# Altium project RespiraWorks Ventilator.PrjPcb (part 1 of 2)
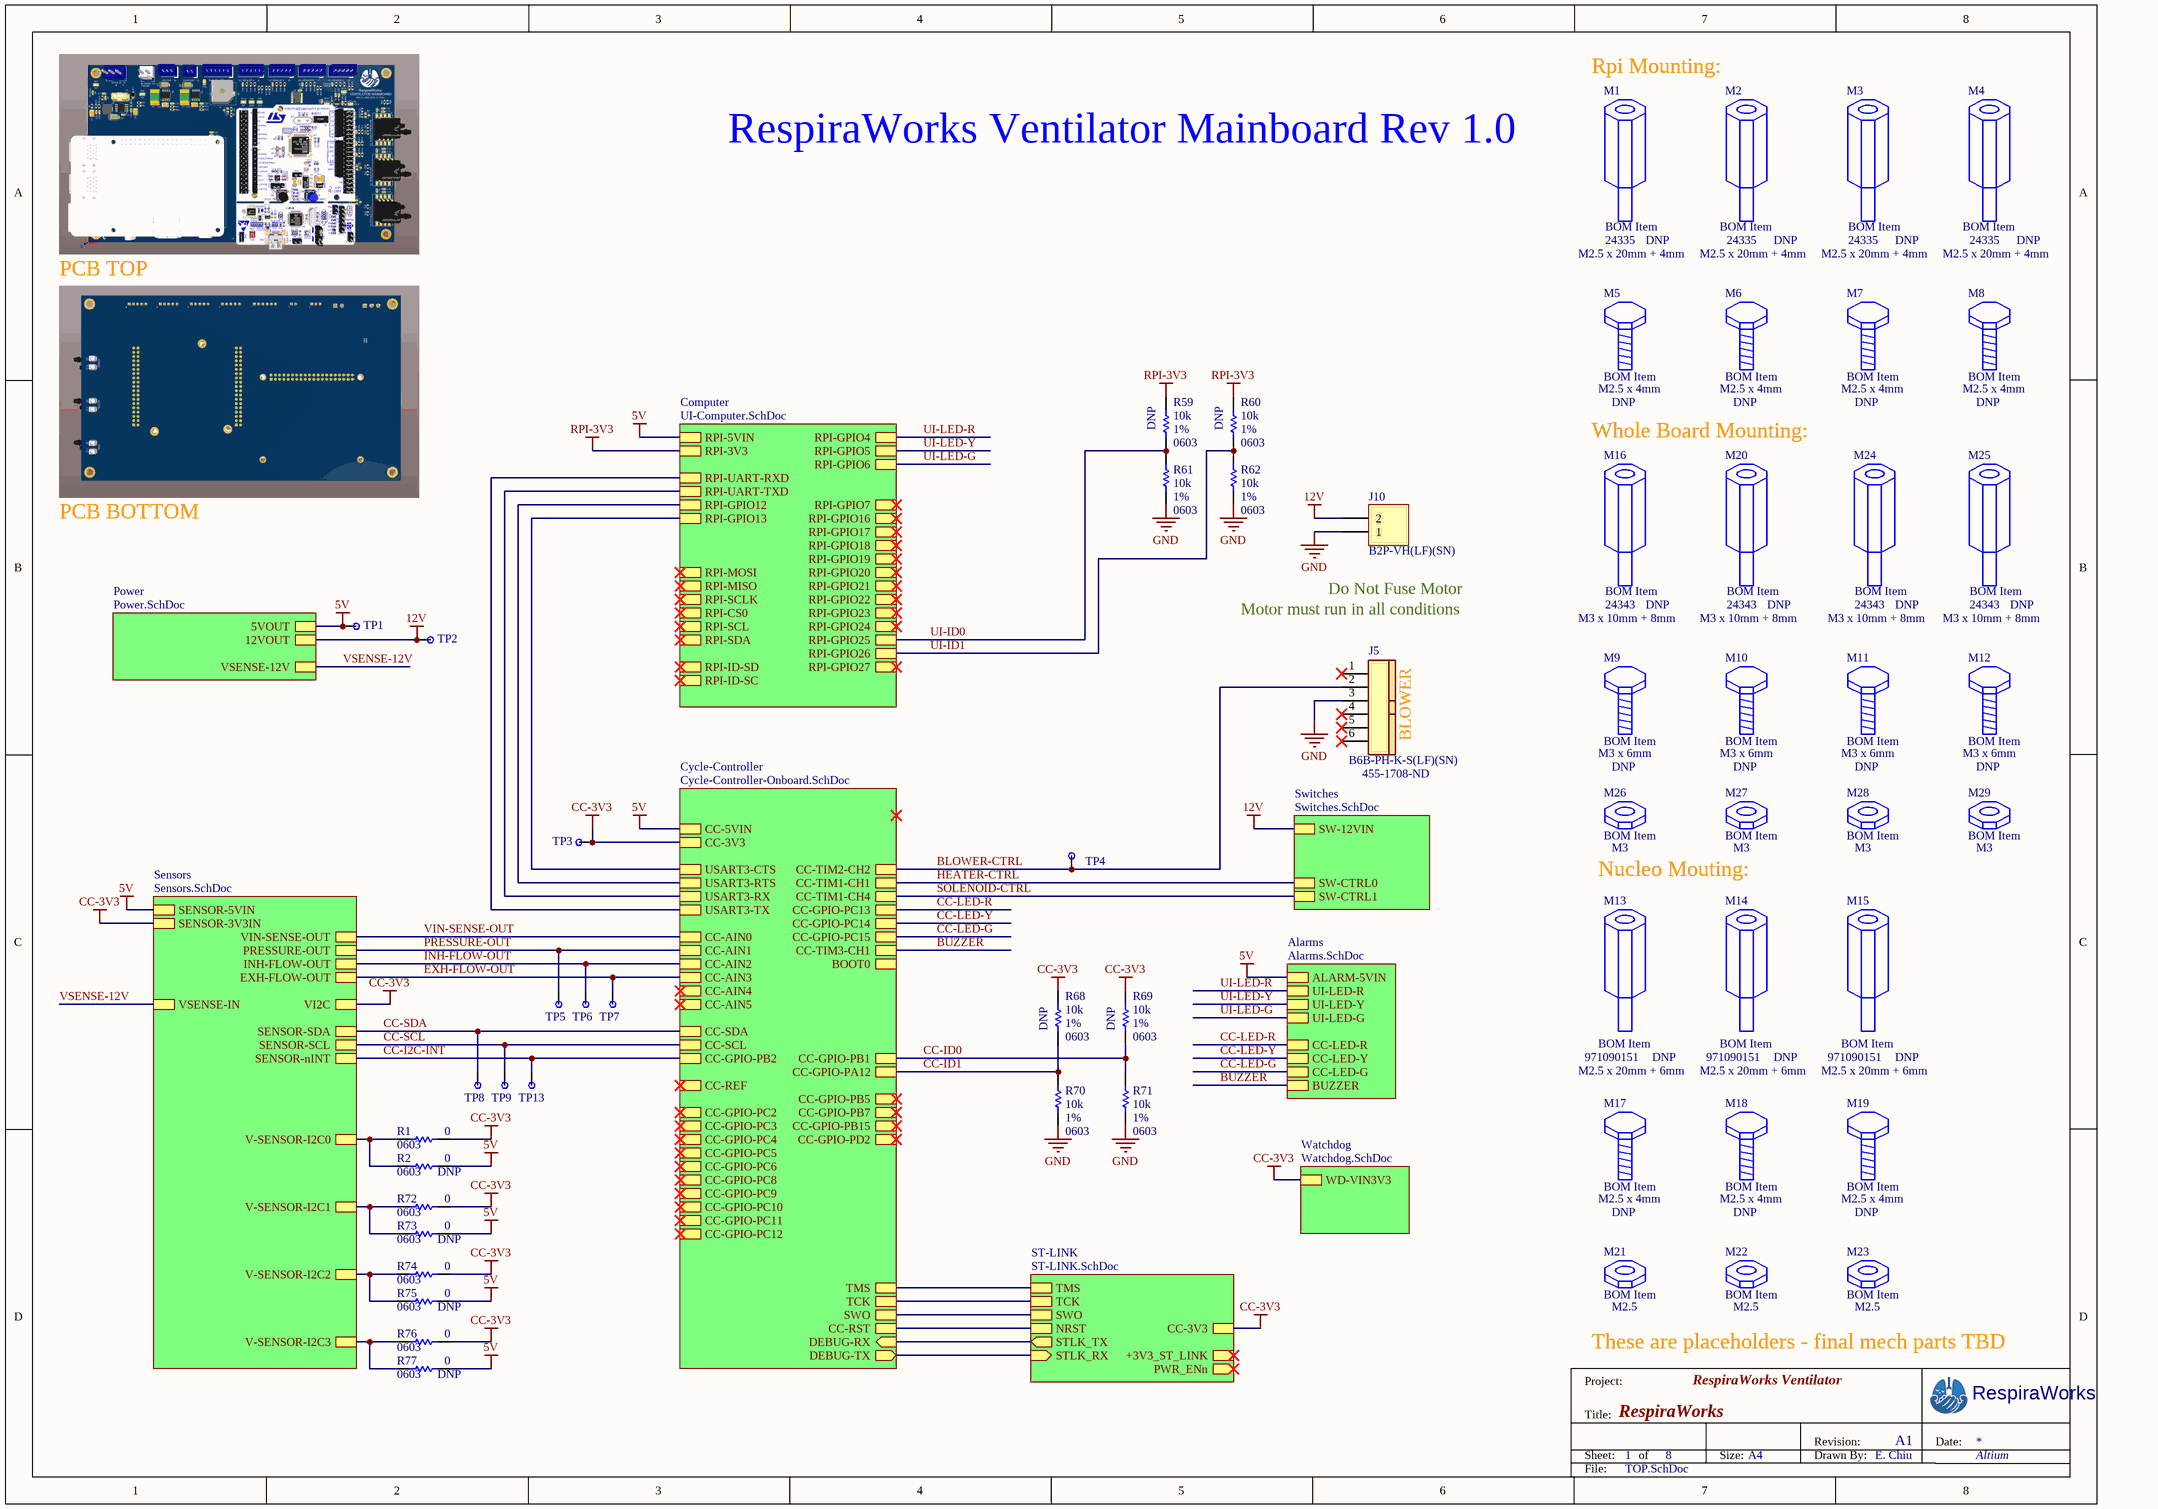
[diagram p0: TOP.SchDoc]
7 sheets, 242 parts. Net scope: hierarchical (ports join the sheet entries above them; power ports are global).
Board file: RespiraWorks Ventilator Rev 1.PcbDoc
Sheets:
  TOP.SchDoc
    Cycle-Controller = Cycle-Controller-Onboard.SchDoc
    Sensors = Sensors.SchDoc
    Switches = Switches.SchDoc
    Watchdog = Watchdog.SchDoc
    Power = Power.SchDoc
    ST-LINK = ST-LINK.SchDoc

## Sheet TOP.SchDoc: RespiraWorks
size A3; CompanyName: RespiraWorks; DrawnBy: E. Chiu; Organization: Altium; DocumentNumber: 1; Revision: A1; SheetNumber: 1; SheetTotal: 8; PageSetup: Record=PageOptions|CenterHorizontal=True|CenterVertical=True|PrintScale=0.67|XCorrection=1.00|YCorrection=1.00|PrintKind=0|BorderSize=5000000|LeftOffset=0|BottomOffset=0|Orientation=2|PaperLength=1000|PaperWidth=1000|Scale=100|PaperSource=276|PrintQuality=-3|MediaType=1|DitherType=10|PrintScaleMode=1|PaperKind=11"x17" 279.4x431.8mm|PaperIndex=3; ProjectName: FALCON 3S

### Parts
J5  B6B-PH-K-S(LF)(SN)  Supplier Part Number 1: 455-1708-ND  [JST_B6B-XH-AM]
J10  B2P-VH(LF)(SN)  [B2P-VH(LF)(SN)]
M1  BOM Item  value M2.5 x 20mm + 4mm  Manufacturer P/N: 24335  Do Not Populate: DNP  (mechanical)
M2  BOM Item  value M2.5 x 20mm + 4mm  Manufacturer P/N: 24335  Do Not Populate: DNP  (mechanical)
M3  BOM Item  value M2.5 x 20mm + 4mm  Manufacturer P/N: 24335  Do Not Populate: DNP  (mechanical)
M4  BOM Item  value M2.5 x 20mm + 4mm  Manufacturer P/N: 24335  Do Not Populate: DNP  (mechanical)
M5  BOM Item  value M2.5 x 4mm  Do Not Populate: DNP  (mechanical)
M6  BOM Item  value M2.5 x 4mm  Do Not Populate: DNP  (mechanical)
M7  BOM Item  value M2.5 x 4mm  Do Not Populate: DNP  (mechanical)
M8  BOM Item  value M2.5 x 4mm  Do Not Populate: DNP  (mechanical)
M9  BOM Item  value M3 x 6mm  Do Not Populate: DNP  (mechanical)
M10  BOM Item  value M3 x 6mm  Do Not Populate: DNP  (mechanical)
M11  BOM Item  value M3 x 6mm  Do Not Populate: DNP  (mechanical)
M12  BOM Item  value M3 x 6mm  Do Not Populate: DNP  (mechanical)
M13  BOM Item  value M2.5 x 20mm + 6mm  Manufacturer P/N: 971090151  Do Not Populate: DNP  (mechanical)
M14  BOM Item  value M2.5 x 20mm + 6mm  Manufacturer P/N: 971090151  Do Not Populate: DNP  (mechanical)
M15  BOM Item  value M2.5 x 20mm + 6mm  Manufacturer P/N: 971090151  Do Not Populate: DNP  (mechanical)
M16  BOM Item  value M3 x 10mm + 8mm  Manufacturer P/N: 24343  Do Not Populate: DNP  (mechanical)
M17  BOM Item  value M2.5 x 4mm  Do Not Populate: DNP  (mechanical)
M18  BOM Item  value M2.5 x 4mm  Do Not Populate: DNP  (mechanical)
M19  BOM Item  value M2.5 x 4mm  Do Not Populate: DNP  (mechanical)
M20  BOM Item  value M3 x 10mm + 8mm  Manufacturer P/N: 24343  Do Not Populate: DNP  (mechanical)
M21  BOM Item  value M2.5  (mechanical)
M22  BOM Item  value M2.5  (mechanical)
M23  BOM Item  value M2.5  (mechanical)
M24  BOM Item  value M3 x 10mm + 8mm  Manufacturer P/N: 24343  Do Not Populate: DNP  (mechanical)
M25  BOM Item  value M3 x 10mm + 8mm  Manufacturer P/N: 24343  Do Not Populate: DNP  (mechanical)
M26  BOM Item  value M3  (mechanical)
M27  BOM Item  value M3  (mechanical)
M28  BOM Item  value M3  (mechanical)
M29  BOM Item  value M3  (mechanical)
R1  value 0  PCB Package: 0603  [RES0603]  (hidden comment: RES 0603)
R2  value 0  PCB Package: 0603  Do Not Populate: DNP  [RES0603]  (hidden comment: RES 0603)
R59  value 10k  PCB Package: 0603  Tolerance: 1%  Do Not Populate: DNP  [RES0603]  (hidden comment: RES 0603)
R60  value 10k  PCB Package: 0603  Tolerance: 1%  Do Not Populate: DNP  [RES0603]  (hidden comment: RES 0603)
R61  value 10k  PCB Package: 0603  Tolerance: 1%  [RES0603]  (hidden comment: RES 0603)
R62  value 10k  PCB Package: 0603  Tolerance: 1%  [RES0603]  (hidden comment: RES 0603)
R68  value 10k  PCB Package: 0603  Tolerance: 1%  Do Not Populate: DNP  [RES0603]  (hidden comment: RES 0603)
R69  value 10k  PCB Package: 0603  Tolerance: 1%  Do Not Populate: DNP  [RES0603]  (hidden comment: RES 0603)
R70  value 10k  PCB Package: 0603  Tolerance: 1%  [RES0603]  (hidden comment: RES 0603)
R71  value 10k  PCB Package: 0603  Tolerance: 1%  [RES0603]  (hidden comment: RES 0603)
R72  value 0  PCB Package: 0603  [RES0603]  (hidden comment: RES 0603)
R73  value 0  PCB Package: 0603  Do Not Populate: DNP  [RES0603]  (hidden comment: RES 0603)
R74  value 0  PCB Package: 0603  [RES0603]  (hidden comment: RES 0603)
R75  value 0  PCB Package: 0603  Do Not Populate: DNP  [RES0603]  (hidden comment: RES 0603)
R76  value 0  PCB Package: 0603  [RES0603]  (hidden comment: RES 0603)
R77  value 0  PCB Package: 0603  Do Not Populate: DNP  [RES0603]  (hidden comment: RES 0603)
TP1  TP-SMT  [TP-5015]  (value not drawn)
TP2  TP-SMT  [TP-5015]  (value not drawn)
TP3  TP-SMT  [TP-5015]  (value not drawn)
TP4  TP-SMT  [TP-5015]  (value not drawn)
TP5  TP-SMT  [TP-5015]  (value not drawn)
TP6  TP-SMT  [TP-5015]  (value not drawn)
TP7  TP-SMT  [TP-5015]  (value not drawn)
TP8  TP-SMT  [TP-5015]  (value not drawn)
TP9  TP-SMT  [TP-5015]  (value not drawn)
TP13  TP-SMT  [TP-5015]  (value not drawn)

### Sub-sheets
Alarms = Alarms.SchDoc (file not in this document): BUZZER, CC-LED-R, UI-LED-Y, CC-LED-G, UI-LED-G, UI-LED-R, CC-LED-Y, ALARM-5VIN
Computer = UI-Computer.SchDoc (file not in this document): RPI-SDA, RPI-SCL, RPI-GPIO6, RPI-GPIO7, RPI-ID-SC, RPI-GPIO12, RPI-GPIO24, RPI-GPIO25, RPI-GPIO4, RPI-GPIO18, RPI-UART-TXD, RPI-GPIO16, RPI-SCLK, RPI-GPIO27, RPI-MOSI, RPI-3V3, RPI-MISO, RPI-GPIO17, RPI-GPIO20, RPI-GPIO23, RPI-GPIO19, RPI-ID-SD, RPI-GPIO22, RPI-GPIO26, RPI-CS0, RPI-UART-RXD, RPI-GPIO13, RPI-GPIO21, RPI-GPIO5, RPI-5VIN
Cycle-Controller = Cycle-Controller-Onboard.SchDoc: CC-3V3, CC-AIN5, CC-AIN1, CC-TIM2-CH2, CC-AIN2, CC-GPIO-PA12, CC-TIM1-CH1, CC-TIM3-CH1, CC-GPIO-PB1, CC-RST, CC-AIN3, CC-GPIO-PB5, CC-AIN4, CC-AIN0, CC-REF, CC-5VIN, CC-SCL, CC-SDA, USART3-RX, USART3-CTS, USART3-TX, USART3-RTS, CC-GPIO-PC14, CC-GPIO-PC13, CC-GPIO-PC15, CC-GPIO-PB2, CC-TIM1-CH4, CC-GPIO-PC11, CC-GPIO-PC10, CC-GPIO-PC4, CC-GPIO-PB15, CC-GPIO-PC2, CC-GPIO-PC8, CC-GPIO-PC5, CC-GPIO-PC9, CC-GPIO-PC6, CC-GPIO-PC12, CC-GPIO-PD2, CC-GPIO-PC3, CC-GPIO-PB7, BOOT0, TCK, DEBUG-TX (out), SWO, DEBUG-RX (in), TMS
Power = Power.SchDoc: 5VOUT, VSENSE-12V, 12VOUT
Sensors = Sensors.SchDoc: INH-FLOW-OUT, SENSOR-5VIN, PRESSURE-OUT, EXH-FLOW-OUT, VIN-SENSE-OUT, VSENSE-IN, SENSOR-SDA, V-SENSOR-I2C0, VI2C, SENSOR-nINT, SENSOR-SCL, SENSOR-3V3IN, V-SENSOR-I2C1, V-SENSOR-I2C3, V-SENSOR-I2C2
ST-LINK = ST-LINK.SchDoc: STLK_RX (in), STLK_TX (out), PWR_ENn (out), CC-3V3, TCK, TMS, NRST, SWO, +3V3_ST_LINK
Switches = Switches.SchDoc: SW-CTRL1, SW-12VIN, SW-CTRL0
Watchdog = Watchdog.SchDoc: WD-VIN3V3

### Nets
5V: R2.2 R73.2 R75.2 R77.2 TP1.1 ; sheet Cycle-Controller/CC-5VIN, sheet Computer/RPI-5VIN, sheet Sensors/SENSOR-5VIN, sheet Alarms/ALARM-5VIN, sheet Power/5VOUT
12V: J10.2 TP2.1 ; sheet Sensors/VSENSE-IN, sheet Switches/SW-12VIN, sheet Power/VSENSE-12V, sheet Power/12VOUT  [also labelled VSENSE-12V]
CC-3V3: R1.2 R68.2 R69.2 R72.2 R74.2 R76.2 TP3.1 ; sheet Cycle-Controller/CC-3V3, sheet Sensors/VI2C, sheet Sensors/SENSOR-3V3IN, sheet Watchdog/WD-VIN3V3, sheet ST-LINK/CC-3V3
GND: J5.3 J10.1 R61.1 R62.1 R70.1 R71.1
RPI-3V3: R59.2 R60.2 ; sheet Computer/RPI-3V3
BLOWER-CTRL: J5.2 TP4.1 ; sheet Cycle-Controller/CC-TIM2-CH2
BUZZER: sheet Cycle-Controller/CC-TIM3-CH1, sheet Alarms/BUZZER
CC-I2C-INT: TP13.1 ; sheet Cycle-Controller/CC-GPIO-PB2, sheet Sensors/SENSOR-nINT
CC-ID0: R69.1 R71.2 ; sheet Cycle-Controller/CC-GPIO-PB1
CC-ID1: R68.1 R70.2 ; sheet Cycle-Controller/CC-GPIO-PA12
CC-LED-G: sheet Cycle-Controller/CC-GPIO-PC15, sheet Alarms/CC-LED-G
CC-LED-R: sheet Cycle-Controller/CC-GPIO-PC13, sheet Alarms/CC-LED-R
CC-LED-Y: sheet Cycle-Controller/CC-GPIO-PC14, sheet Alarms/CC-LED-Y
CC-SCL: TP9.1 ; sheet Cycle-Controller/CC-SCL, sheet Sensors/SENSOR-SCL
CC-SDA: TP8.1 ; sheet Cycle-Controller/CC-SDA, sheet Sensors/SENSOR-SDA
EXH-FLOW-OUT: TP7.1 ; sheet Cycle-Controller/CC-AIN3, sheet Sensors/EXH-FLOW-OUT
HEATER-CTRL: sheet Cycle-Controller/CC-TIM1-CH1, sheet Switches/SW-CTRL0
INH-FLOW-OUT: TP6.1 ; sheet Cycle-Controller/CC-AIN2, sheet Sensors/INH-FLOW-OUT
NRST: sheet Cycle-Controller/CC-RST, sheet ST-LINK/NRST
PRESSURE-OUT: TP5.1 ; sheet Cycle-Controller/CC-AIN1, sheet Sensors/PRESSURE-OUT
SOLENOID-CTRL: sheet Cycle-Controller/CC-TIM1-CH4, sheet Switches/SW-CTRL1
STLK_RX: sheet Cycle-Controller/DEBUG-TX, sheet ST-LINK/STLK_RX
STLK_TX: sheet Cycle-Controller/DEBUG-RX, sheet ST-LINK/STLK_TX
T_JTCK: sheet Cycle-Controller/TCK, sheet ST-LINK/TCK
T_JTMS: sheet Cycle-Controller/TMS, sheet ST-LINK/TMS
T_SWO: sheet Cycle-Controller/SWO, sheet ST-LINK/SWO
UI-ID0: R59.1 R61.2 ; sheet Computer/RPI-GPIO25
UI-ID1: R60.1 R62.2 ; sheet Computer/RPI-GPIO26
UI-LED-G: sheet Computer/RPI-GPIO6, sheet Alarms/UI-LED-G
UI-LED-R: sheet Computer/RPI-GPIO4, sheet Alarms/UI-LED-R
UI-LED-Y: sheet Computer/RPI-GPIO5, sheet Alarms/UI-LED-Y
V-SENSOR-I2C0: R1.1 R2.1 ; sheet Sensors/V-SENSOR-I2C0
V-SENSOR-I2C1: R72.1 R73.1 ; sheet Sensors/V-SENSOR-I2C1
V-SENSOR-I2C2: R74.1 R75.1 ; sheet Sensors/V-SENSOR-I2C2
V-SENSOR-I2C3: R76.1 R77.1 ; sheet Sensors/V-SENSOR-I2C3
VIN-SENSE-OUT: sheet Cycle-Controller/CC-AIN0, sheet Sensors/VIN-SENSE-OUT
(unnamed): sheet Cycle-Controller/USART3-RX, sheet Computer/RPI-UART-TXD
(unnamed): sheet Cycle-Controller/USART3-CTS, sheet Computer/RPI-GPIO13
(unnamed): sheet Cycle-Controller/USART3-TX, sheet Computer/RPI-UART-RXD
(unnamed): sheet Cycle-Controller/USART3-RTS, sheet Computer/RPI-GPIO12

Not connected (* = marked no-connect by the designer): J5 1* 4* 5* 6*

### Notes on the sheet
- Rpi Mounting:
- (near M1) RespiraWorks Ventilator Mainboard Rev 1.0
- PCB TOP
- Whole Board Mounting:
- PCB BOTTOM
- Motor must run in all conditions
- Do Not Fuse Motor
- (near J5) BLOWER
- Nucleo Mouting:
- Project:
- These are placeholders - final mech parts TBD
- RespiraWorks Ventilator
- Title:
- Sheet:
- of
- Size:
- A4
- Drawn By:
- Revision:
- Date:
- File:

### Library data of the parts
J5 = B6B-PH-K-S(LF)(SN): CONN HEADER PH TOP 6POS 2MM; Manufacturer: JST Sales America Inc.; Connector Type: Header, Shrouded; Number of Positions: 6; Number of Positions Loaded: All; Pitch: 0.079" (2.00mm); Supplier 1: Digi-Key; Manufacturer Part Number: B6B-PH-K-S(LF)(SN); RoHS: RoHS Compliant; Category: Connectors, Interconnects; Stock 1: 30111; Pricing 1: 1=0.33, 10=0.313, 100=0.2194, 500=0.18808, 1000=0.15674, 5000=0.13435, 10000=0.12539 (USD); Packaging: Bulk; Part Status: Active; Contact Type: Male Pin; Number of Rows: 1; Row Spacing: -; Contact Mating Length: 0.130" (3.30mm); Mounting Type: Through Hole; Termination: Press-Fit, Solder; Fastening Type: Detent Lock; Features: -; Contact Finish: Tin; Contact Finish Thickness: -; Color: Natural; ComponentLink1URL: http://www.jst-mfg.com/product/pdf/eng/ePH.pdf; ComponentLink1Description: http://www.jst-mfg.com/product/pdf/eng/ePH.pdf; Manufacturer P/N: B6B-PH-K-S(LF)(SN)
J10 = B2P-VH(LF)(SN): JST-VH HEADER VERT 2POS 3.96MM; Manufacturer: JST; Do Not Populate: *; Manufacturer P/N: B2P-VH(LF)(SN)
M1-M4 M16 M20 M24 M25 = STANDOFF: [BOM Item] Generic Standoff; Manufacturer: Keystone
M5-M8 M17-M19 = SCREW: [BOM Item] Generic Nut; Manufacturer: Keystone; Manufacturer P/N: 29300
M9-M12 = SCREW: [BOM Item] Generic Nut; Manufacturer: Keystone; Manufacturer P/N: 29311
M13-M15 = STANDOFF: [BOM Item] Generic Standoff; Manufacturer: Wurth
M21-M23 = NUT: [BOM Item] Generic Nut; Manufacturer: Keystone; Manufacturer P/N: 4707; Do Not Populate: DNP
M26-M29 = NUT: [BOM Item] Generic Nut; Manufacturer: B&F; Manufacturer P/N: MHNZ 003; Do Not Populate: DNP
R1 R2 R72-R77 = RES 0603: Manufacturer P/N: RC0603JR-070RL; Manufacturer: Yageo; Tolerance: 5%
  R1 R72 R74 R76: Do Not Populate: *
R59-R62 R68-R71 = RES 0603: Manufacturer P/N: ERJ-3EKF1002V; Manufacturer: Panasonic
  R61 R62 R70 R71: Do Not Populate: *
TP1-TP9 TP13 = TP-SMT: Keystone 5015 SMT Mini Testpoint; Manufacturer P/N: 5015; Manufacturer: Keystone; PCB Package: TP-5015; Tolerance: 5015; Do Not Populate: *; Value: *

## Sheet Cycle-Controller-Onboard.SchDoc: RespiraWorks
size A3; CompanyName: RespiraWorks; DrawnBy: E. Chiu; Organization: Altium; DocumentNumber: 4; Revision: A1; SheetNumber: 4; SheetTotal: 8; PageSetup: Record=PageOptions|CenterHorizontal=True|CenterVertical=True|PrintScale=0.67|XCorrection=1.00|YCorrection=1.00|PrintKind=0|BorderSize=5000000|LeftOffset=0|BottomOffset=0|Orientation=2|PaperLength=1000|PaperWidth=1000|Scale=100|PaperSource=276|PrintQuality=-3|MediaType=1|DitherType=10|PrintScaleMode=1|PaperKind=11"x17" 279.4x431.8mm|PaperIndex=3; ProjectName: FALCON 3S
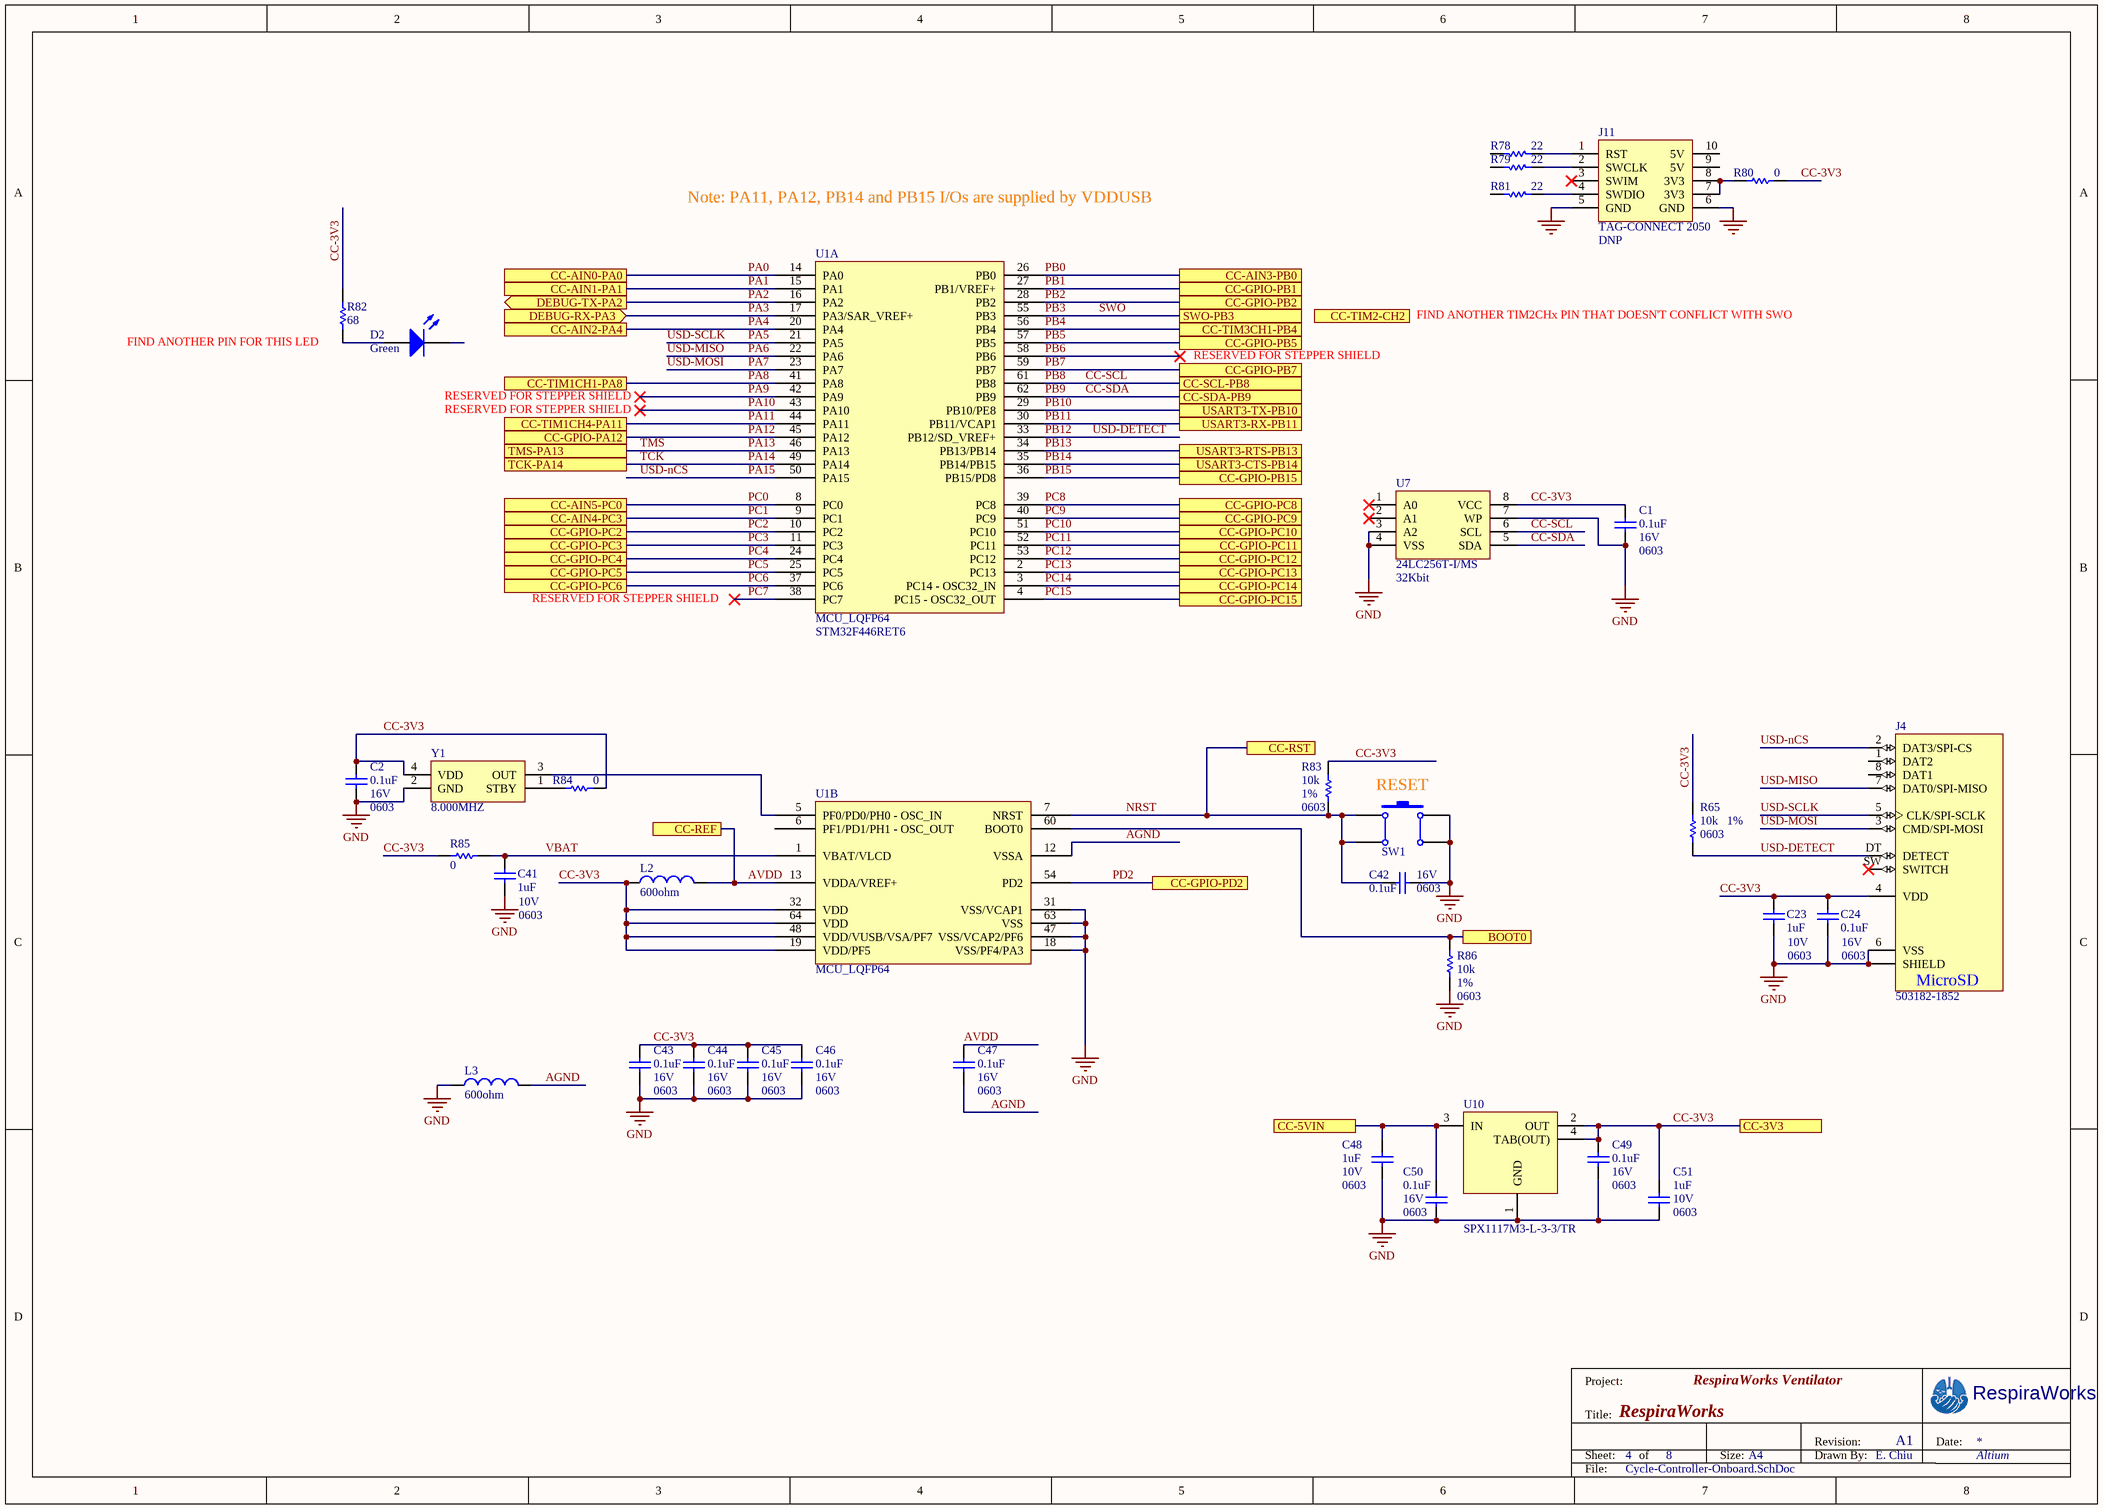
[diagram p1: Cycle-Controller-Onboard.SchDoc]

### Parts
C1  value 0.1uF  Voltage: 16V  PCB Package: 0603  [CAP0603]  (hidden comment: CAP 0603)
C2  value 0.1uF  Voltage: 16V  PCB Package: 0603  [CAP0603]  (hidden comment: CAP 0603)
C23  value 1uF  Voltage: 10V  PCB Package: 0603  [CAP0603]  (hidden comment: CAP 0603)
C24  value 0.1uF  Voltage: 16V  PCB Package: 0603  [CAP0603]  (hidden comment: CAP 0603)
C41  value 1uF  Voltage: 10V  PCB Package: 0603  [CAP0603]  (hidden comment: CAP 0603)
C42  value 0.1uF  Voltage: 16V  PCB Package: 0603  [CAP0603]  (hidden comment: CAP 0603)
C43  value 0.1uF  Voltage: 16V  PCB Package: 0603  [CAP0603]  (hidden comment: CAP 0603)
C44  value 0.1uF  Voltage: 16V  PCB Package: 0603  [CAP0603]  (hidden comment: CAP 0603)
C45  value 0.1uF  Voltage: 16V  PCB Package: 0603  [CAP0603]  (hidden comment: CAP 0603)
C46  value 0.1uF  Voltage: 16V  PCB Package: 0603  [CAP0603]  (hidden comment: CAP 0603)
C47  value 0.1uF  Voltage: 16V  PCB Package: 0603  [CAP0603]  (hidden comment: CAP 0603)
C48  value 1uF  Voltage: 10V  PCB Package: 0603  [CAP0603]  (hidden comment: CAP 0603)
C49  value 0.1uF  Voltage: 16V  PCB Package: 0603  [CAP0603]  (hidden comment: CAP 0603)
C50  value 0.1uF  Voltage: 16V  PCB Package: 0603  [CAP0603]  (hidden comment: CAP 0603)
C51  value 1uF  Voltage: 10V  PCB Package: 0603  [CAP0603]  (hidden comment: CAP 0603)
D2  value Green  [LED0603]  (hidden comment: LED 0603)
J4  503182-1852  [503182-1852]
J11  TAG-CONNECT 2050  Do Not Populate: DNP  [TAG-CONNECT-2050]
L2  value 600ohm  [IND0603]  (hidden comment: BEAD)
L3  value 600ohm  [IND0603]  (hidden comment: BEAD)
R65  value 10k  PCB Package: 0603  Tolerance: 1%  [RES0603]  (hidden comment: RES 0603)
R78  value 22  [RES0603]  (hidden comment: RES 0603)
R79  value 22  [RES0603]  (hidden comment: RES 0603)
R80  value 0  [RES0603]  (hidden comment: RES 0603)
R81  value 22  [RES0603]  (hidden comment: RES 0603)
R82  value 68  [RES0603]  (hidden comment: RES 0603)
R83  value 10k  PCB Package: 0603  Tolerance: 1%  [RES0603]  (hidden comment: RES 0603)
R84  value 0  [RES0603]  (hidden comment: RES 0603)
R85  value 0  [RES0603]  (hidden comment: RES 0603)
R86  value 10k  PCB Package: 0603  Tolerance: 1%  [RES0603]  (hidden comment: RES 0603)
SW1  BUTTON  [PB-6MM-J-LEAD]  (value not drawn)
U1  MCU_LQFP64  Manufacturer P/N: STM32F446RET6  [64-LQFP]  (parts A,B of 2)
U7  value 32Kbit  [8-MSOP]  (hidden comment: 256Kbit)
U10  Manufacturer P/N: SPX1117M3-L-3-3/TR  [3-SOT223]  (hidden comment: NCP1117ST33T3G)
Y1  8.000MHZ  [4-OSC3225]

### Ports
BOOT0, CC-3V3, CC-5VIN, CC-AIN0-PA0, CC-AIN1-PA1, CC-AIN2-PA4, CC-AIN3-PB0, CC-AIN4-PC3, CC-AIN5-PC0, CC-GPIO-PA12, CC-GPIO-PB1, CC-GPIO-PB2, CC-GPIO-PB5, CC-GPIO-PB7, CC-GPIO-PB15, CC-GPIO-PC2, CC-GPIO-PC3, CC-GPIO-PC4, CC-GPIO-PC5, CC-GPIO-PC6, CC-GPIO-PC8, CC-GPIO-PC9, CC-GPIO-PC10, CC-GPIO-PC11, CC-GPIO-PC12, CC-GPIO-PC13, CC-GPIO-PC14, CC-GPIO-PC15, CC-GPIO-PD2, CC-REF, CC-RST, CC-SCL-PB8, CC-SDA-PB9, CC-TIM1CH1-PA8, CC-TIM1CH4-PA11, CC-TIM2-CH2, CC-TIM3CH1-PB4, DEBUG-RX-PA3 (in), DEBUG-TX-PA2 (out), SWO-PB3, TCK-PA14, TMS-PA13, USART3-CTS-PB14, USART3-RTS-PB13, USART3-RX-PB11, USART3-TX-PB10

### Nets
5V: C48.1 C50.1 U10.3(IN) ; port CC-5VIN
CC-3V3: C1.1 C2.1 C23.1 C24.1 C43.1 C44.1 C45.1 C46.1 C49.1 C51.1 J4.4(VDD) L2.1 R65.2 R80.2 R82.2 R83.2 R84.1 R85.2 U1.19(VDD/PF5) U1.32(VDD) U1.48(VDD/VUSB/VSA/PF7) U1.64(VDD) U7.8(VCC) U10.2(OUT) U10.4(TAB(OUT)) Y1.4(VDD) ; port CC-3V3
GND: C1.2 C2.2 C23.2 C24.2 C41.2 C42.2 C43.2 C44.2 C45.2 C46.2 C48.2 C49.2 C50.2 C51.2 J4.6(VSS) J4.P1(SHIELD) J4.P2(SHIELD) J4.P3(SHIELD) J4.P4(SHIELD) J4.P5(SHIELD) J11.5(GND) J11.6(GND) L3.1 R86.1 SW1.3 SW1.4 U1.18(VSS/PF4/PA3) U1.31(VSS/VCAP1) U1.47(VSS/VCAP2/PF6) U1.63(VSS) U7.3(A2) U7.4(VSS) U7.7(WP) U10.1(GND) Y1.2(GND)
AGND: C47.2 L3.2 U1.12(VSSA)
AVDD: C47.1 L2.2 U1.13(VDDA/VREF+) ; port CC-REF
BOOT0: R86.2 U1.60(BOOT0) ; port BOOT0
CC-SCL: U1.61(PB8) U7.6(SCL) ; port CC-SCL-PB8  [also labelled PB8]
CC-SDA: U1.62(PB9) U7.5(SDA) ; port CC-SDA-PB9  [also labelled PB9]
NRST: C42.1 R83.1 SW1.1 SW1.2 U1.7(NRST) ; port CC-RST
PA0: U1.14(PA0) ; port CC-AIN0-PA0
PA1: U1.15(PA1) ; port CC-AIN1-PA1
PA2: U1.16(PA2) ; port DEBUG-TX-PA2
PA3: U1.17(PA3/SAR_VREF+) ; port DEBUG-RX-PA3
PA4: U1.20(PA4) ; port CC-AIN2-PA4
PA5: J4.5(CLK/SPI-SCLK) U1.21(PA5)  [also labelled USD-SCLK]
PA6: J4.7(DAT0/SPI-MISO) U1.22(PA6)  [also labelled USD-MISO]
PA7: J4.3(CMD/SPI-MOSI) U1.23(PA7)  [also labelled USD-MOSI]
PA8: U1.41(PA8) ; port CC-TIM1CH1-PA8
PA9: U1.42(PA9)
PA10: U1.43(PA10)
PA11: U1.44(PA11) ; port CC-TIM1CH4-PA11
PA12: U1.45(PA12) ; port CC-GPIO-PA12  [project net CC-ID1]
PA13: U1.46(PA13) ; port TMS-PA13  [also labelled TMS]
PA14: U1.49(PA14) ; port TCK-PA14  [also labelled TCK]
PA15: J4.2(DAT3/SPI-CS) U1.50(PA15)  [also labelled USD-nCS]
PB0: U1.26(PB0) ; port CC-AIN3-PB0
PB1: U1.27(PB1/VREF+) ; port CC-GPIO-PB1  [project net CC-ID0]
PB2: U1.28(PB2) ; port CC-GPIO-PB2  [project net CC-I2C-INT]
PB3: U1.55(PB3) ; port SWO-PB3  [also labelled SWO]
PB4: U1.56(PB4) ; port CC-TIM3CH1-PB4
PB5: U1.57(PB5) ; port CC-GPIO-PB5
PB6: U1.58(PB6)
PB7: U1.59(PB7) ; port CC-GPIO-PB7
PB10: U1.29(PB10/PE8) ; port USART3-TX-PB10
PB11: U1.30(PB11/VCAP1) ; port USART3-RX-PB11
PB12: J4.DT(DETECT) R65.1 U1.33(PB12/SD_VREF+)  [also labelled USD-DETECT]
PB13: U1.34(PB13/PB14) ; port USART3-RTS-PB13
PB14: U1.35(PB14/PB15) ; port USART3-CTS-PB14
PB15: U1.36(PB15/PD8) ; port CC-GPIO-PB15
PC0: U1.8(PC0) ; port CC-AIN5-PC0
PC1: U1.9(PC1) ; port CC-AIN4-PC3
PC2: U1.10(PC2) ; port CC-GPIO-PC2
PC3: U1.11(PC3) ; port CC-GPIO-PC3
PC4: U1.24(PC4) ; port CC-GPIO-PC4
PC5: U1.25(PC5) ; port CC-GPIO-PC5
PC6: U1.37(PC6) ; port CC-GPIO-PC6
PC7: U1.38(PC7)
PC8: U1.39(PC8) ; port CC-GPIO-PC8
PC9: U1.40(PC9) ; port CC-GPIO-PC9
PC10: U1.51(PC10) ; port CC-GPIO-PC10
PC11: U1.52(PC11) ; port CC-GPIO-PC11
PC12: U1.53(PC12) ; port CC-GPIO-PC12
PC13: U1.2(PC13) ; port CC-GPIO-PC13  [project net CC-LED-R]
PC14: U1.3(PC14_-_OSC32_IN) ; port CC-GPIO-PC14  [project net CC-LED-Y]
PC15: U1.4(PC15_-_OSC32_OUT) ; port CC-GPIO-PC15  [project net CC-LED-G]
PD2: U1.54(PD2) ; port CC-GPIO-PD2
VBAT: C41.1 R85.1 U1.1(VBAT/VLCD)
NetD2_A: D2.A R82.1
NetJ11_1: J11.1(RST) R78.1
NetJ11_2: J11.2(SWCLK) R79.1
NetJ11_4: J11.4(SWDIO) R81.1
NetJ11_7: J11.7(3V3) J11.8(3V3) R80.1
NetR84_2: R84.2 Y1.1(STBY)
NetU1_5: U1.5(PF0/PD0/PH0_-_OSC_IN) Y1.3(OUT)

Not connected (* = marked no-connect by the designer): D2 K; J4 1(DAT2) 8(DAT1) SW(SWITCH)*; J11 3(SWIM)* 9(5V) 10(5V); R78 2; R79 2; R81 2; U1 6(PF1/PD1/PH1_-_OSC_OUT); U7 1(A0)* 2(A1)*

### Notes on the sheet
- Note: PA11, PA12, PB14 and PB15 I/Os are supplied by VDDUSB
- FIND ANOTHER TIM2CHx PIN THAT DOESN'T CONFLICT WITH SWO
- (near R82) FIND ANOTHER PIN FOR THIS LED
- RESERVED FOR STEPPER SHIELD
- (near D2) RESERVED FOR STEPPER SHIELD
- (near SW1) RESET
- Project:
- RespiraWorks Ventilator
- Title:
- Sheet:
- of
- Size:
- A4
- Drawn By:
- Revision:
- Date:
- File:
- (in symbol 503182-1852) MicroSD

### Library data of the parts
C1 C2 C24 C42-C47 C49 C50 = CAP 0603: Manufacturer P/N: CC0603KRX7R7BB104; Manufacturer: Yageo; Type: X7R; Do Not Populate: *
C23 C41 C48 C51 = CAP 0603: Manufacturer P/N: CC0603KRX7R6BB105; Manufacturer: Yageo; Type: X7R; Do Not Populate: *
D2 = LED 0603: Manufacturer P/N: LTST-C191KGKT; Manufacturer: Lite-On; PCB Package: 0603; Vf: 2V; Intensity: 35mcd@20mA; Color: Green; Do Not Populate: *
J4 = 503182-1852: 10 _8 + 2_ Position Card Connector microSD Surface Mount, Right Angle Gold; Manufacturer: Molex; Manufacturer P/N: 5031821852; Digi-Key_Part_Number: WM12834CT-ND; Digi-Key_Purchase_URL: https://www.digikey.com.tr/product-detail/en/molex/5031821852/WM12834CT-ND/5823232?utm_source=snapeda&utm_medium=aggregator&utm_campaign=symbol; SnapEDA_Link: https://www.snapeda.com/parts/5031821852/Molex/view-part/46835/?ref=snap; Value: *; Package: None
J11 = TC-2050-STLINK: 10-pin TAG-CONNECT Bed of Nails footprint; Manufacturer P/N: 2050; Manufacturer: TAG-CONNECT; PCB Package: 2050; Tolerance: *; Value: *
L2 L3 = FERRITE 0603: Manufacturer P/N: 742792651; Manufacturer: Wurth; PCB Package: 0603; Tolerance: *; Do Not Populate: *
R65 R83 R86 = RES 0603: as R59 on sheet TOP; Do Not Populate: *
R78 R79 R81 = RES 0603: Manufacturer P/N: RC0603FR-0722RL; Manufacturer: Yageo; PCB Package: 0603; Tolerance: 1%; Do Not Populate: *
R80 R84 = RES 0603: Manufacturer P/N: ERJ-3GEY0R00V; Manufacturer: Panasonic; PCB Package: 0603; Tolerance: *; Do Not Populate: *
R82 = RES 0603: Manufacturer P/N: ERJ-3EKF68R0V; Manufacturer: Panasonic; PCB Package: 0603; Tolerance: 1%; Do Not Populate: *
R85 = RES 0603: Manufacturer P/N: ERJ-3GEY0R00V; Manufacturer: Panasonic; PCB Package: 0603; Do Not Populate: DNP; Tolerance: *
SW1 = PUSHBUTTON-SQ-6MM-TACT-J-LEAD: PUSHBUTTON, 6MM SQ, TACT, J-Lead; Manufacturer P/N: TL3301AF160QJ; Manufacturer: E-Switch; PCB Package: PB-6MM-J-LEAD; Tolerance: *; Do Not Populate: *; Value: *
U1 = MCU_LQFP64: IC MCU 32BIT 512KB FLASH 64LQFP; Manufacturer: ST Micro; PCB Package: 64-LQFP
U7 = 24LC256T-I/MS: IC EEPROM 256KBIT I2C 400KHZ 8MSOP; Manufacturer: Microchip; Tolerance: 25ppm; PCB Package: 8-MSOP; Do Not Populate: *; Manufacturer P/N: 24LC256T-I/MS
U10 = NCP1117ST33T3G: LDO, 3.3V out, 1A, 20V in, SOT-223, 0.8W Pd max; Manufacturer: Exar; PCB Package: SOT223; Do Not Populate: *
Y1 = ASEMB-8.000MHZ-LC-T: OSC MEMS 8.000MHZ CMOS SMD; Manufacturer: Abracon; PCB Package: 3225; Tolerance: 50ppm; Manufacturer P/N: ASEMB-8.000MHZ-LC-T; Do Not Populate: *; Value: 8.000MHZ

## Sheet Sensors.SchDoc: RespiraWorks
size A3; CompanyName: RespiraWorks; DrawnBy: E. Chiu; Organization: Altium; DocumentNumber: 7; Revision: A1; SheetNumber: 7; SheetTotal: 8; PageSetup: Record=PageOptions|CenterHorizontal=True|CenterVertical=True|PrintScale=0.67|XCorrection=1.00|YCorrection=1.00|PrintKind=0|BorderSize=5000000|LeftOffset=0|BottomOffset=0|Orientation=2|PaperLength=1000|PaperWidth=1000|Scale=100|PaperSource=276|PrintQuality=-3|MediaType=1|DitherType=10|PrintScaleMode=1|PaperKind=11"x17" 279.4x431.8mm|PaperIndex=3; ProjectName: FALCON 3S
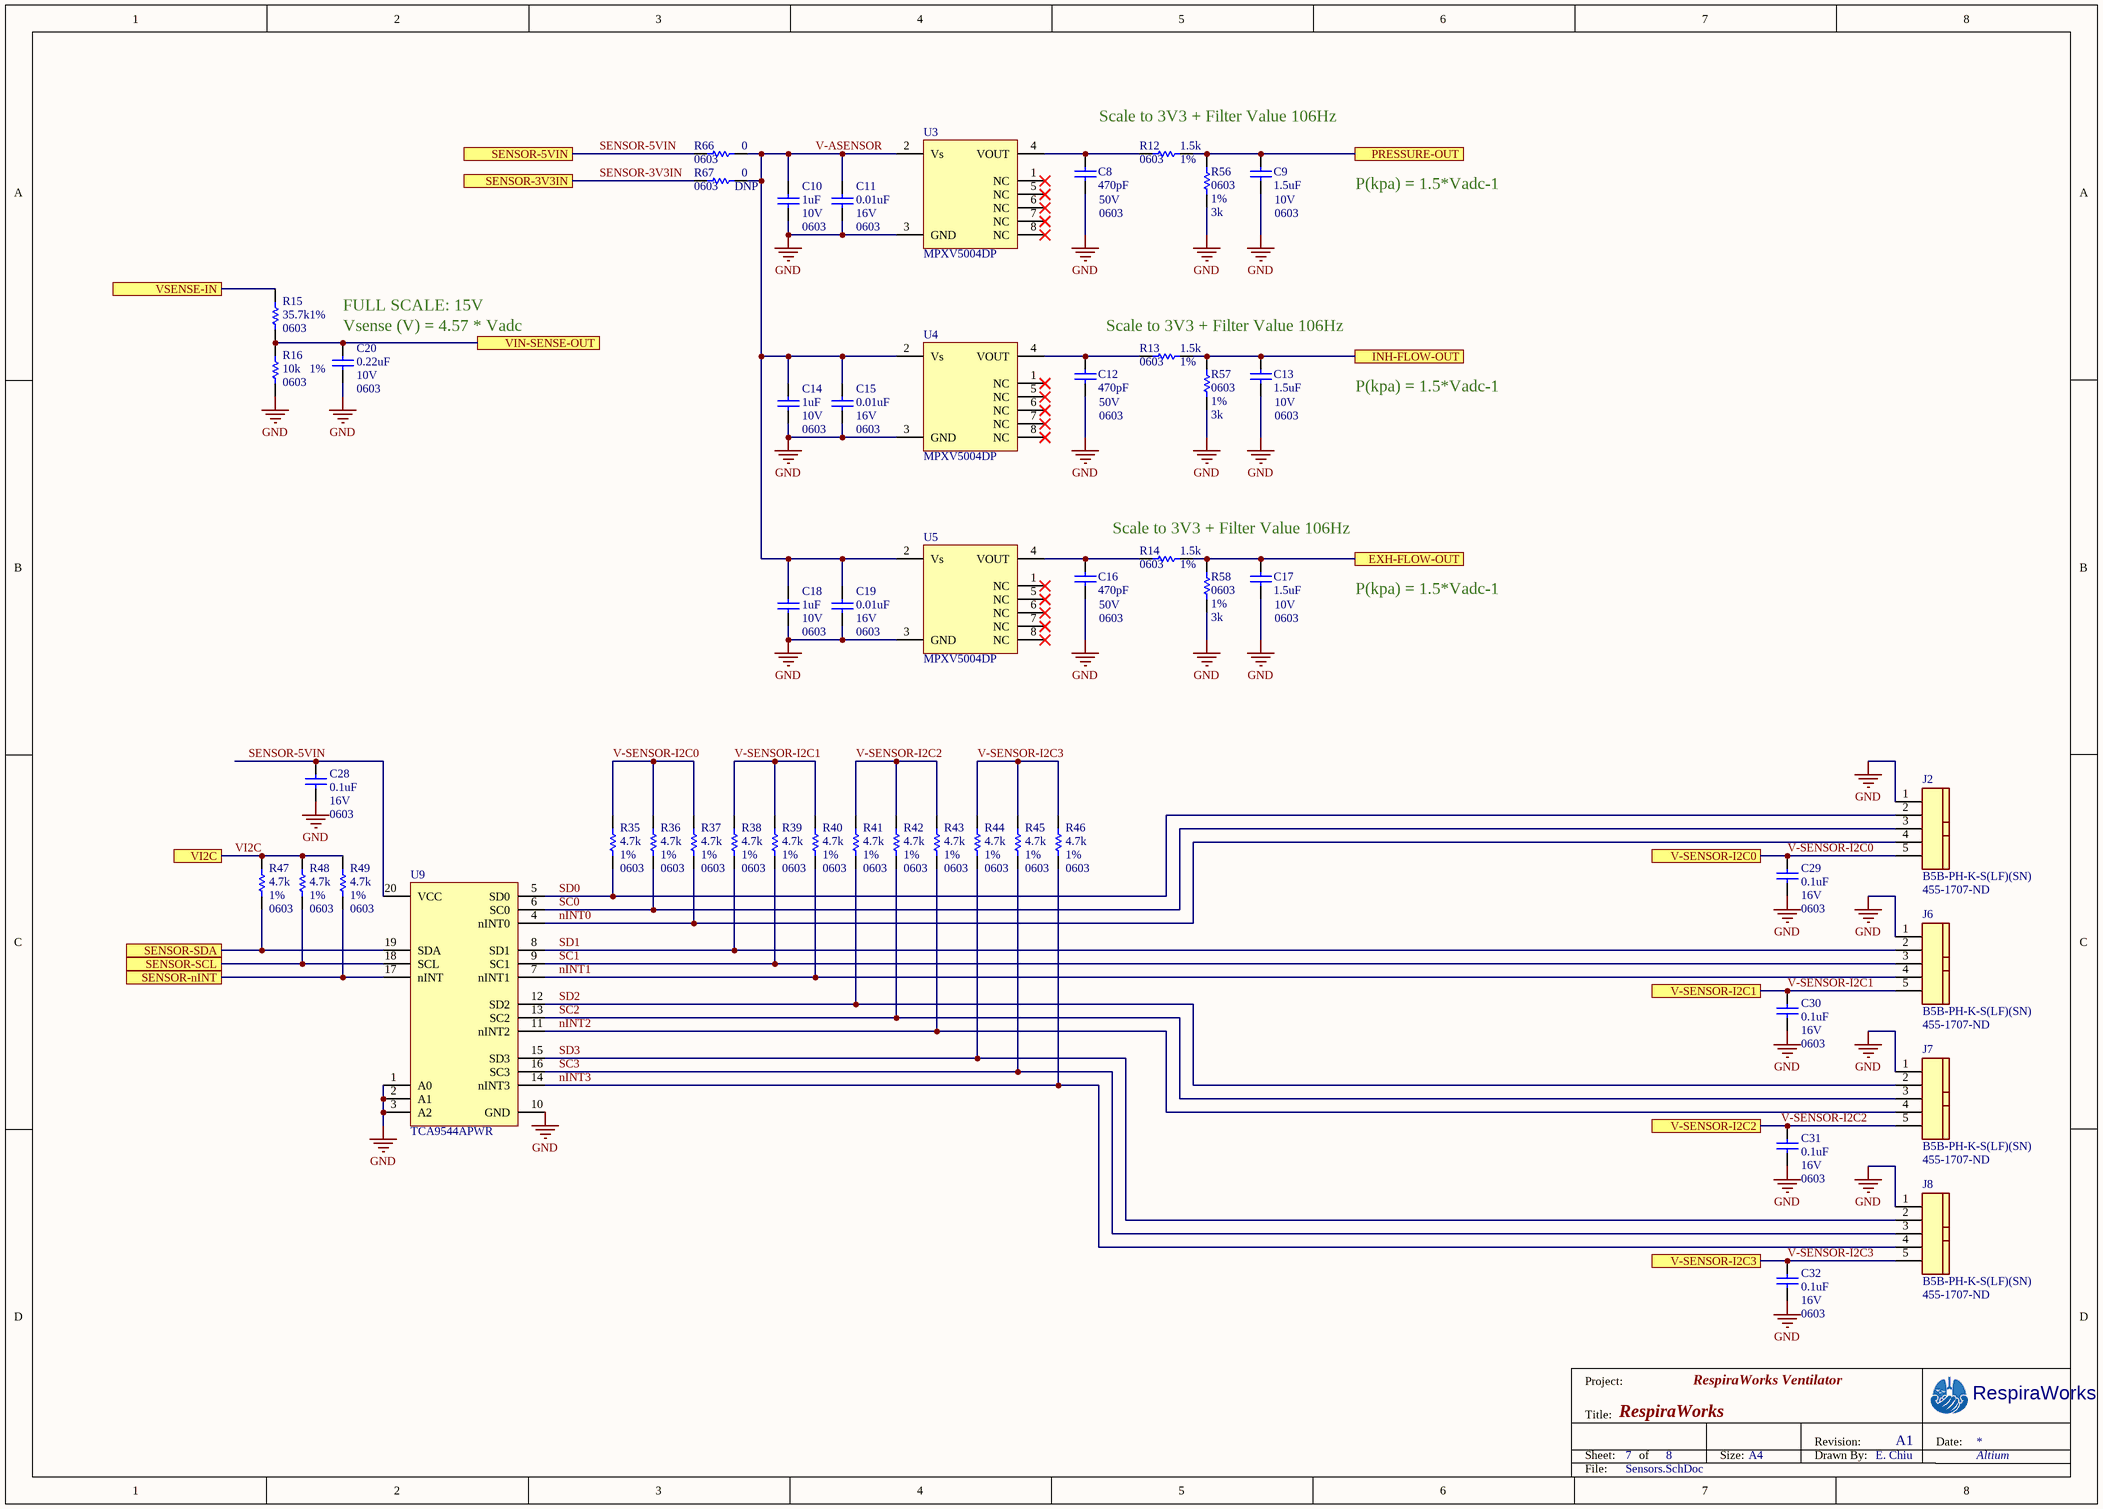
[diagram p2: Sensors.SchDoc]

### Parts
C8  value 470pF  Voltage: 50V  PCB Package: 0603  [CAP0603]  (hidden comment: CAP 0603)
C9  value 1.5uF  Voltage: 10V  PCB Package: 0603  [CAP0603]  (hidden comment: CAP 0603)
C10  value 1uF  Voltage: 10V  PCB Package: 0603  [CAP0603]  (hidden comment: CAP 0603)
C11  value 0.01uF  Voltage: 16V  PCB Package: 0603  [CAP0603]  (hidden comment: CAP 0603)
C12  value 470pF  Voltage: 50V  PCB Package: 0603  [CAP0603]  (hidden comment: CAP 0603)
C13  value 1.5uF  Voltage: 10V  PCB Package: 0603  [CAP0603]  (hidden comment: CAP 0603)
C14  value 1uF  Voltage: 10V  PCB Package: 0603  [CAP0603]  (hidden comment: CAP 0603)
C15  value 0.01uF  Voltage: 16V  PCB Package: 0603  [CAP0603]  (hidden comment: CAP 0603)
C16  value 470pF  Voltage: 50V  PCB Package: 0603  [CAP0603]  (hidden comment: CAP 0603)
C17  value 1.5uF  Voltage: 10V  PCB Package: 0603  [CAP0603]  (hidden comment: CAP 0603)
C18  value 1uF  Voltage: 10V  PCB Package: 0603  [CAP0603]  (hidden comment: CAP 0603)
C19  value 0.01uF  Voltage: 16V  PCB Package: 0603  [CAP0603]  (hidden comment: CAP 0603)
C20  value 0.22uF  Voltage: 10V  PCB Package: 0603  [CAP0603]  (hidden comment: CAP 0603)
C28  value 0.1uF  Voltage: 16V  PCB Package: 0603  [CAP0603]  (hidden comment: CAP 0603)
C29  value 0.1uF  Voltage: 16V  PCB Package: 0603  [CAP0603]  (hidden comment: CAP 0603)
C30  value 0.1uF  Voltage: 16V  PCB Package: 0603  [CAP0603]  (hidden comment: CAP 0603)
C31  value 0.1uF  Voltage: 16V  PCB Package: 0603  [CAP0603]  (hidden comment: CAP 0603)
C32  value 0.1uF  Voltage: 16V  PCB Package: 0603  [CAP0603]  (hidden comment: CAP 0603)
J2  B5B-PH-K-S(LF)(SN)  Supplier Part Number 1: 455-1707-ND  [JST_B5B-XH-AM]
J6  B5B-PH-K-S(LF)(SN)  Supplier Part Number 1: 455-1707-ND  [JST_B5B-XH-AM]
J7  B5B-PH-K-S(LF)(SN)  Supplier Part Number 1: 455-1707-ND  [JST_B5B-XH-AM]
J8  B5B-PH-K-S(LF)(SN)  Supplier Part Number 1: 455-1707-ND  [JST_B5B-XH-AM]
R12  value 1.5k  PCB Package: 0603  Tolerance: 1%  [RES0603]  (hidden comment: RES 0603)
R13  value 1.5k  PCB Package: 0603  Tolerance: 1%  [RES0603]  (hidden comment: RES 0603)
R14  value 1.5k  PCB Package: 0603  Tolerance: 1%  [RES0603]  (hidden comment: RES 0603)
R15  value 35.7k  PCB Package: 0603  Tolerance: 1%  [RES0603]  (hidden comment: RES 0603)
R16  value 10k  PCB Package: 0603  Tolerance: 1%  [RES0603]  (hidden comment: RES 0603)
R35  value 4.7k  PCB Package: 0603  Tolerance: 1%  [RES0603]  (hidden comment: RES 0603)
R36  value 4.7k  PCB Package: 0603  Tolerance: 1%  [RES0603]  (hidden comment: RES 0603)
R37  value 4.7k  PCB Package: 0603  Tolerance: 1%  [RES0603]  (hidden comment: RES 0603)
R38  value 4.7k  PCB Package: 0603  Tolerance: 1%  [RES0603]  (hidden comment: RES 0603)
R39  value 4.7k  PCB Package: 0603  Tolerance: 1%  [RES0603]  (hidden comment: RES 0603)
R40  value 4.7k  PCB Package: 0603  Tolerance: 1%  [RES0603]  (hidden comment: RES 0603)
R41  value 4.7k  PCB Package: 0603  Tolerance: 1%  [RES0603]  (hidden comment: RES 0603)
R42  value 4.7k  PCB Package: 0603  Tolerance: 1%  [RES0603]  (hidden comment: RES 0603)
R43  value 4.7k  PCB Package: 0603  Tolerance: 1%  [RES0603]  (hidden comment: RES 0603)
R44  value 4.7k  PCB Package: 0603  Tolerance: 1%  [RES0603]  (hidden comment: RES 0603)
R45  value 4.7k  PCB Package: 0603  Tolerance: 1%  [RES0603]  (hidden comment: RES 0603)
R46  value 4.7k  PCB Package: 0603  Tolerance: 1%  [RES0603]  (hidden comment: RES 0603)
R47  value 4.7k  PCB Package: 0603  Tolerance: 1%  [RES0603]  (hidden comment: RES 0603)
R48  value 4.7k  PCB Package: 0603  Tolerance: 1%  [RES0603]  (hidden comment: RES 0603)
R49  value 4.7k  PCB Package: 0603  Tolerance: 1%  [RES0603]  (hidden comment: RES 0603)
R56  value 3k  PCB Package: 0603  Tolerance: 1%  [RES0603]  (hidden comment: RES 0603)
R57  value 3k  PCB Package: 0603  Tolerance: 1%  [RES0603]  (hidden comment: RES 0603)
R58  value 3k  PCB Package: 0603  Tolerance: 1%  [RES0603]  (hidden comment: RES 0603)
R66  value 0  PCB Package: 0603  [RES0603]  (hidden comment: RES 0603)
R67  value 0  PCB Package: 0603  Do Not Populate: DNP  [RES0603]  (hidden comment: RES 0603)
U3  MPXV5004DP  [8-SOP-MPXV]
U4  MPXV5004DP  [8-SOP-MPXV]
U5  MPXV5004DP  [8-SOP-MPXV]
U9  TCA9544APWR  [20-pw]

### Ports
EXH-FLOW-OUT, INH-FLOW-OUT, PRESSURE-OUT, SENSOR-3V3IN, SENSOR-5VIN, SENSOR-nINT, SENSOR-SCL, SENSOR-SDA, V-SENSOR-I2C0, V-SENSOR-I2C1, V-SENSOR-I2C2, V-SENSOR-I2C3, VI2C, VIN-SENSE-OUT, VSENSE-IN

### Nets
12V: R15.2 ; port VSENSE-IN
GND: C8.1 C9.1 C10.2 C11.2 C12.1 C13.1 C14.2 C15.2 C16.1 C17.1 C18.2 C19.2 C20.1 C28.2 C29.2 C30.2 C31.2 C32.2 J2.1 J6.1 J7.1 J8.1 R16.1 R56.1 R57.1 R58.1 U3.3(GND) U4.3(GND) U5.3(GND) U9.1(A0) U9.2(A1) U9.3(A2) U9.10(GND)
SENSOR-3V3IN: R47.2 R48.2 R49.2 R67.1 ; port VI2C, port SENSOR-3V3IN  [also labelled VI2C]  [project net CC-3V3]
SENSOR-5VIN: C28.1 R66.1 U9.20(VCC) ; port SENSOR-5VIN  [project net 5V]
CC-I2C-INT: R49.1 U9.17(nINT) ; port SENSOR-nINT
CC-SCL: R48.1 U9.18(SCL) ; port SENSOR-SCL
CC-SDA: R47.1 U9.19(SDA) ; port SENSOR-SDA
EXH-FLOW-OUT: C17.2 R14.2 R58.2 ; port EXH-FLOW-OUT
INH-FLOW-OUT: C13.2 R13.2 R57.2 ; port INH-FLOW-OUT
nINT0: J2.4 R37.1 U9.4(nINT0)
nINT1: J6.4 R40.1 U9.7(nINT1)
nINT2: J7.4 R43.1 U9.11(nINT2)
nINT3: J8.4 R46.1 U9.14(nINT3)
PRESSURE-OUT: C9.2 R12.2 R56.2 ; port PRESSURE-OUT
SC0: J2.3 R36.1 U9.6(SC0)
SC1: J6.3 R39.1 U9.9(SC1)
SC2: J7.3 R42.1 U9.13(SC2)
SC3: J8.3 R45.1 U9.16(SC3)
SD0: J2.2 R35.1 U9.5(SD0)
SD1: J6.2 R38.1 U9.8(SD1)
SD2: J7.2 R41.1 U9.12(SD2)
SD3: J8.2 R44.1 U9.15(SD3)
V-ASENSOR: C10.1 C11.1 C14.1 C15.1 C18.1 C19.1 R66.2 R67.2 U3.2(Vs) U4.2(Vs) U5.2(Vs)
V-SENSOR-I2C0: C29.1 J2.5 R35.2 R36.2 R37.2 ; port V-SENSOR-I2C0
V-SENSOR-I2C1: C30.1 J6.5 R38.2 R39.2 R40.2 ; port V-SENSOR-I2C1
V-SENSOR-I2C2: C31.1 J7.5 R41.2 R42.2 R43.2 ; port V-SENSOR-I2C2
V-SENSOR-I2C3: C32.1 J8.5 R44.2 R45.2 R46.2 ; port V-SENSOR-I2C3
VIN-SENSE-OUT: C20.2 R15.1 R16.2 ; port VIN-SENSE-OUT
NetC8_2: C8.2 R12.1 U3.4(VOUT)
NetC12_2: C12.2 R13.1 U4.4(VOUT)
NetC16_2: C16.2 R14.1 U5.4(VOUT)

Not connected (* = marked no-connect by the designer): U3 1(NC)* 5(NC)* 6(NC)* 7(NC)* 8(NC)*; U4 1(NC)* 5(NC)* 6(NC)* 7(NC)* 8(NC)*; U5 1(NC)* 5(NC)* 6(NC)* 7(NC)* 8(NC)*

### Notes on the sheet
- Scale to 3V3 + Filter Value 106Hz
- P(kpa) = 1.5*Vadc-1
- (near C20) FULL SCALE: 15V
- (near C20) Vsense (V) = 4.57 * Vadc
- Project:
- RespiraWorks Ventilator
- Title:
- Sheet:
- of
- Size:
- A4
- Drawn By:
- Revision:
- Date:
- File:

### Library data of the parts
C8 C12 C16 = CAP 0603: Manufacturer P/N: CC0603MRX7R9BB471; Manufacturer: Yageo; Type: X7R; Do Not Populate: *
C9 C13 C17 = CAP 0603: Manufacturer P/N: C1608X7R1A155K080AC; Manufacturer: TDK; Type: X7R; Do Not Populate: *
C10 C14 C18 = CAP 0603: as C23 on sheet Cycle-Controller-Onboard; Do Not Populate: *
C11 C15 C19 = CAP 0603: Manufacturer P/N: CL10B103KO8NNNC; Manufacturer: Samsung; Type: X7R; Do Not Populate: *
C20 = CAP 0603: Manufacturer P/N: CAP CER 0.22UF 10V X7R 0603; Manufacturer: Yageo; Type: X7R; Do Not Populate: *
C28-C32 = CAP 0603: as C1 on sheet Cycle-Controller-Onboard; Do Not Populate: *
J2 J6-J8 = B5B-PH-K-S(LF)(SN): CONN HEADER PH TOP 5POS 2MM; Manufacturer: JST Sales America Inc.; Connector Type: Header, Shrouded; Number of Positions: 5; Number of Positions Loaded: All; Pitch: 0.079" (2.00mm); Supplier 1: Digi-Key; Manufacturer Part Number: B5B-PH-K-S(LF)(SN); RoHS: RoHS Compliant; Category: Connectors, Interconnects; Stock 1: 20730; Pricing 1: 1=0.29, 10=0.274, 100=0.1918, 500=0.16438, 1000=0.13699, 5000=0.11742, 10000=0.10959 (USD); Packaging: Bulk; Part Status: Active; Contact Type: Male Pin; Number of Rows: 1; Row Spacing: -; Contact Mating Length: 0.130" (3.30mm); Mounting Type: Through Hole; Termination: Press-Fit, Solder; Fastening Type: Detent Lock; Features: -; Contact Finish: Tin; Contact Finish Thickness: -; Color: Natural; ComponentLink1URL: http://www.jst-mfg.com/product/pdf/eng/ePH.pdf; ComponentLink1Description: http://www.jst-mfg.com/product/pdf/eng/ePH.pdf; Manufacturer P/N: B5B-PH-K-S(LF)(SN)
R12-R14 = RES 0603: Manufacturer P/N: RC0603FR-071K5L; Manufacturer: Yageo; Do Not Populate: *
R15 = RES 0603: Manufacturer P/N: RC0603FR-0735K7L; Manufacturer: Yageo; Do Not Populate: *
R16 = RES 0603: Manufacturer P/N: RC0603FR-0710KL; Manufacturer: Yageo; Do Not Populate: *
R35-R49 = RES 0603: Manufacturer P/N: RC0603FR-074K7L; Manufacturer: Yageo; Do Not Populate: *
R56-R58 = RES 0603: Manufacturer P/N: RC0603FR-073KL; Manufacturer: Yageo; Do Not Populate: *
R66 R67 = RES 0603: as R1 on sheet TOP
  R66: Do Not Populate: *
U3-U5 = MPXV5004DP: Pressure Sensor 0.57PSI (3.92kPa) Differential Male - 0.13" (3.3mm) Tube, Dual 1 V ~ 4.9 V 8-BSOP (0.475", 12.06mm Width) Dual Ports, Same Side; Manufacturer: NXP; Do Not Populate: *; PCB Package: 8-SOP-MPXV; Manufacturer P/N: MPXV5004DP
U9 = TCA9544APWR: IC I2C SW 4CH W/RESET 20TSSOP; Manufacturer: Texas Instruments; PCB Package: 20-TSSOP; Do Not Populate: *; Manufacturer P/N: TCA9544APWR

## Sheet Switches.SchDoc: RespiraWorks
size A3; CompanyName: RespiraWorks; DrawnBy: E. Chiu; Organization: Altium; DocumentNumber: 8; Revision: A1; SheetNumber: 8; SheetTotal: 8; PageSetup: Record=PageOptions|CenterHorizontal=True|CenterVertical=True|PrintScale=0.67|XCorrection=1.00|YCorrection=1.00|PrintKind=0|BorderSize=5000000|LeftOffset=0|BottomOffset=0|Orientation=2|PaperLength=1000|PaperWidth=1000|Scale=100|PaperSource=276|PrintQuality=-3|MediaType=1|DitherType=10|PrintScaleMode=1|PaperKind=11"x17" 279.4x431.8mm|PaperIndex=3; ProjectName: FALCON 3S
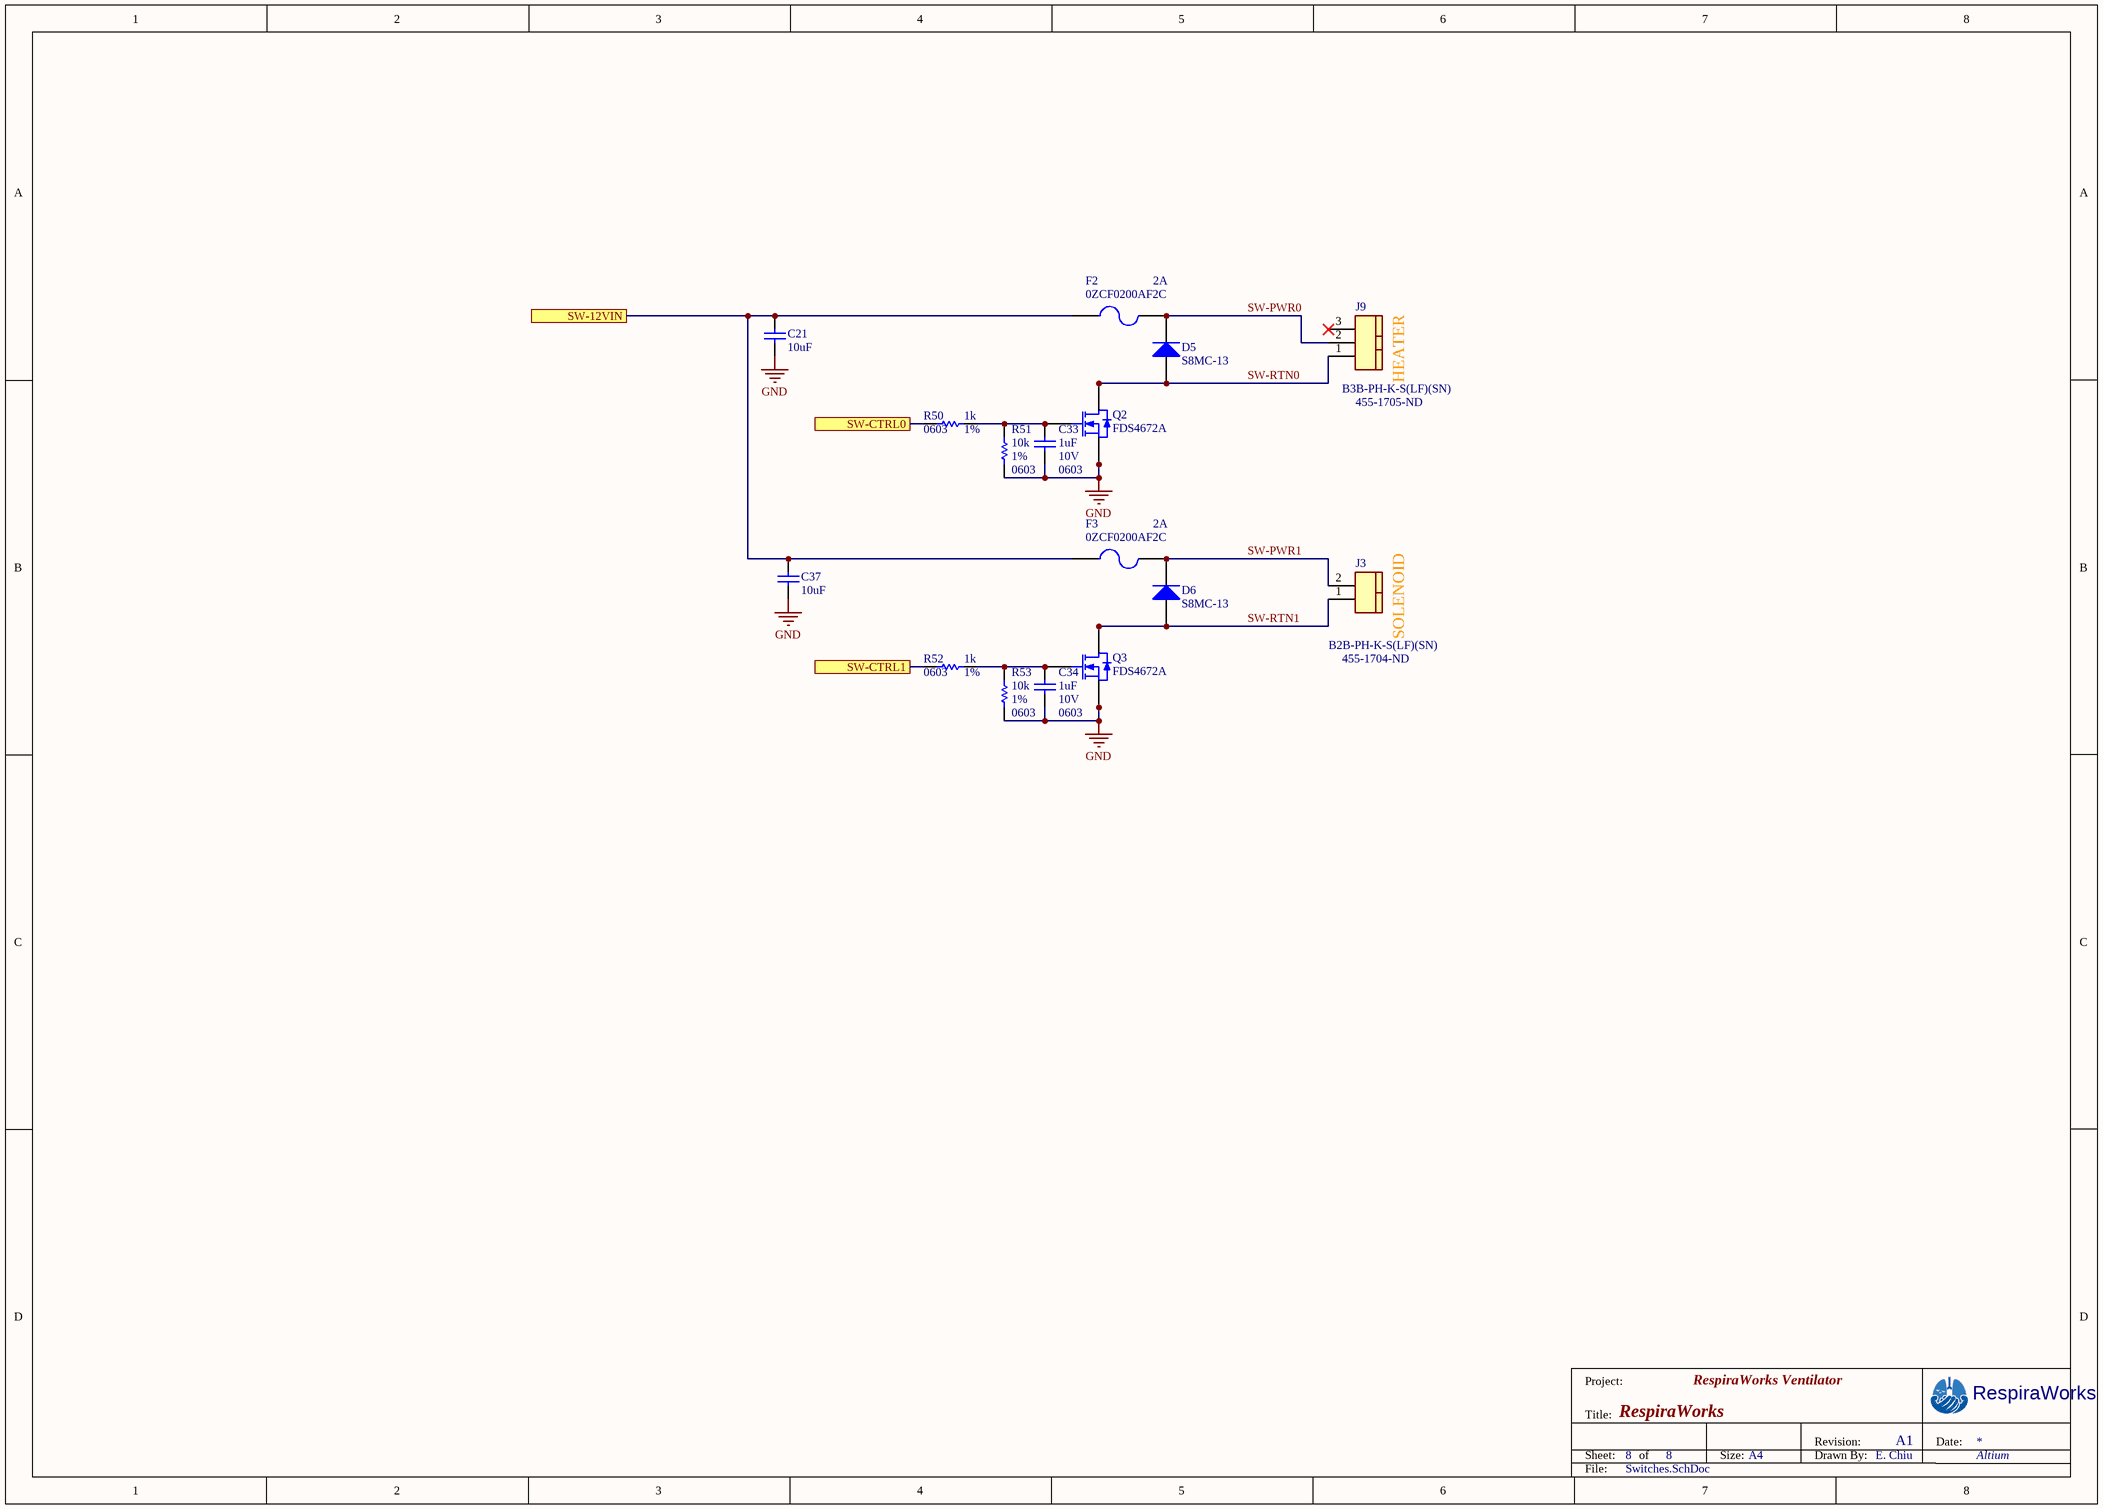
[diagram p3: Switches.SchDoc]

### Parts
C21  value 10uF  [CAP1210]  (hidden comment: CAP 1210)
C33  value 1uF  Voltage: 10V  PCB Package: 0603  [CAP0603]  (hidden comment: CAP 0603)
C34  value 1uF  Voltage: 10V  PCB Package: 0603  [CAP0603]  (hidden comment: CAP 0603)
C37  value 10uF  [CAP1210]  (hidden comment: CAP 1210)
D5  S8MC-13  [DO-214AC]
D6  S8MC-13  [DO-214AC]
F2  I(hold): 2A  [FUSE2920]  (hidden comment: 0ZCF0200AF2C)
F3  I(hold): 2A  [FUSE2920]  (hidden comment: 0ZCF0200AF2C)
J3  B2B-PH-K-S(LF)(SN)  Supplier Part Number 1: 455-1704-ND  [JST_B2B-XH-AM]
J9  B3B-PH-K-S(LF)(SN)  Supplier Part Number 1: 455-1705-ND  [JST_B3B-XH-AM]
Q2  FDS4672A  [8-SOIC]
Q3  FDS4672A  [8-SOIC]
R50  value 1k  PCB Package: 0603  Tolerance: 1%  [RES0603]  (hidden comment: RES 0603)
R51  value 10k  PCB Package: 0603  Tolerance: 1%  [RES0603]  (hidden comment: RES 0603)
R52  value 1k  PCB Package: 0603  Tolerance: 1%  [RES0603]  (hidden comment: RES 0603)
R53  value 10k  PCB Package: 0603  Tolerance: 1%  [RES0603]  (hidden comment: RES 0603)

### Ports
SW-12VIN, SW-CTRL0, SW-CTRL1

### Nets
12V: C21.2 C37.2 F2.1 F3.1 ; port SW-12VIN
GND: C21.1 C33.2 C34.2 C37.1 Q2.1(S) Q2.2(S) Q2.3(S) Q3.1(S) Q3.2(S) Q3.3(S) R51.2 R53.2
HEATER-CTRL: R50.2 ; port SW-CTRL0
SOLENOID-CTRL: R52.2 ; port SW-CTRL1
SW-PWR0: D5.K F2.2 J9.2
SW-PWR1: D6.K F3.2 J3.2
SW-RTN0: D5.A J9.1 Q2.5(D) Q2.6(D) Q2.7(D) Q2.8(D)
SW-RTN1: D6.A J3.1 Q3.5(D) Q3.6(D) Q3.7(D) Q3.8(D)
NetC33_1: C33.1 Q2.4(G) R50.1 R51.1
NetC34_1: C34.1 Q3.4(G) R52.1 R53.1

Not connected (* = marked no-connect by the designer): J9 3*

### Notes on the sheet
- (near J9) HEATER
- (near J3) SOLENOID
- Project:
- RespiraWorks Ventilator
- Title:
- Sheet:
- of
- Size:
- A4
- Drawn By:
- Revision:
- Date:
- File:

### Library data of the parts
C21 C37 = CAP 1210: Manufacturer P/N: GRM32DR71E106KA12L; Manufacturer: Murata; Voltage: 25V; PCB Package: 1210; Type: X7R; Do Not Populate: *
C33 C34 = CAP 0603: as C23 on sheet Cycle-Controller-Onboard; Do Not Populate: *
D5 D6 = S8MC-13: Ultra-Fast Signal Diode, Silicon, 100V, 300mA; Manufacturer: Diodes Inc.; Type: GP Standard Recovery; Reverse Voltage: 1000V; I(max): 8A; PCB Package: DO-214AB, SMC; Do Not Populate: *; Manufacturer P/N: S8MC-13
F2 F3 = 0ZCF0200AF2C: PTC Fuse, 2A Hold, 24V, 2920 size; Manufacturer: Belfuse; I(trip): 4A; PCB Package: 2920; Manufacturer P/N: 0ZCF0200AF2C; Do Not Populate: *; V(max): 24V
J3 = B2B-PH-K-S(LF)(SN): CONN HEADER PH TOP 2POS 2MM; Manufacturer: JST Sales America Inc.; Connector Type: Header, Shrouded; Number of Positions: 2; Number of Positions Loaded: All; Pitch: 0.079" (2.00mm); Supplier 1: Digi-Key; Manufacturer Part Number: B2B-PH-K-S(LF)(SN); RoHS: RoHS Compliant; Category: Connectors, Interconnects; Stock 1: 207967; Pricing 1: 1=0.17, 10=0.162, 100=0.1002, 500=0.08288, 1000=0.07252, 5000=0.06216, 10000=0.06044 (USD); Packaging: Bulk; Part Status: Active; Contact Type: Male Pin; Number of Rows: 1; Row Spacing: -; Contact Mating Length: 0.130" (3.30mm); Mounting Type: Through Hole; Termination: Press-Fit, Solder; Fastening Type: Detent Lock; Features: -; Contact Finish: Tin; Contact Finish Thickness: -; Color: Natural; ComponentLink1URL: http://www.jst-mfg.com/product/pdf/eng/ePH.pdf; ComponentLink1Description: http://www.jst-mfg.com/product/pdf/eng/ePH.pdf; Manufacturer P/N: B2B-PH-K-S(LF)(SN)
J9 = B3B-PH-K-S(LF)(SN): CONN HEADER PH TOP 3POS 2MM; Manufacturer: JST Sales America Inc.; Connector Type: Header, Shrouded; Number of Positions: 3; Number of Positions Loaded: All; Pitch: 0.079" (2.00mm); Supplier 1: Digi-Key; Manufacturer Part Number: B3B-PH-K-S(LF)(SN); RoHS: RoHS Compliant; Category: Connectors, Interconnects; Stock 1: 55340; Pricing 1: 1=0.19, 10=0.182, 100=0.1262, 500=0.10676, 1000=0.08736, 5000=0.07765, 10000=0.07037 (USD); Packaging: Bulk; Part Status: Active; Contact Type: Male Pin; Number of Rows: 1; Row Spacing: -; Contact Mating Length: 0.130" (3.30mm); Mounting Type: Through Hole; Termination: Press-Fit, Solder; Fastening Type: Detent Lock; Features: -; Contact Finish: Tin; Contact Finish Thickness: -; Color: Natural; ComponentLink1URL: http://www.jst-mfg.com/product/pdf/eng/ePH.pdf; ComponentLink1Description: http://www.jst-mfg.com/product/pdf/eng/ePH.pdf; Manufacturer P/N: B3B-PH-K-S(LF)(SN)
Q2 Q3 = FDS4672A: Transistor, BJT NPN, General Purpose 40V; Manufacturer: On Semi; Vds(max): 60V; Ic(max): 11A; Rds_on: 13mohm; PCB Package: 8-SOIC; Manufacturer P/N: FDS4672A
R50 R52 = RES 0603: Manufacturer P/N: RC0603FR-071KL; Manufacturer: Yageo; Do Not Populate: *
R51 R53 = RES 0603: as R16 on sheet Sensors; Do Not Populate: *

## Sheet Watchdog.SchDoc: RespiraWorks
size A3; CompanyName: RespiraWorks; DrawnBy: E. Chiu; Organization: Altium; DocumentNumber: 5; Revision: A1; SheetNumber: 5; SheetTotal: 8; PageSetup: Record=PageOptions|CenterHorizontal=True|CenterVertical=True|PrintScale=0.67|XCorrection=1.00|YCorrection=1.00|PrintKind=0|BorderSize=5000000|LeftOffset=0|BottomOffset=0|Orientation=2|PaperLength=1000|PaperWidth=1000|Scale=100|PaperSource=276|PrintQuality=-3|MediaType=1|DitherType=10|PrintScaleMode=1|PaperKind=11"x17" 279.4x431.8mm|PaperIndex=3; ProjectName: FALCON 3S
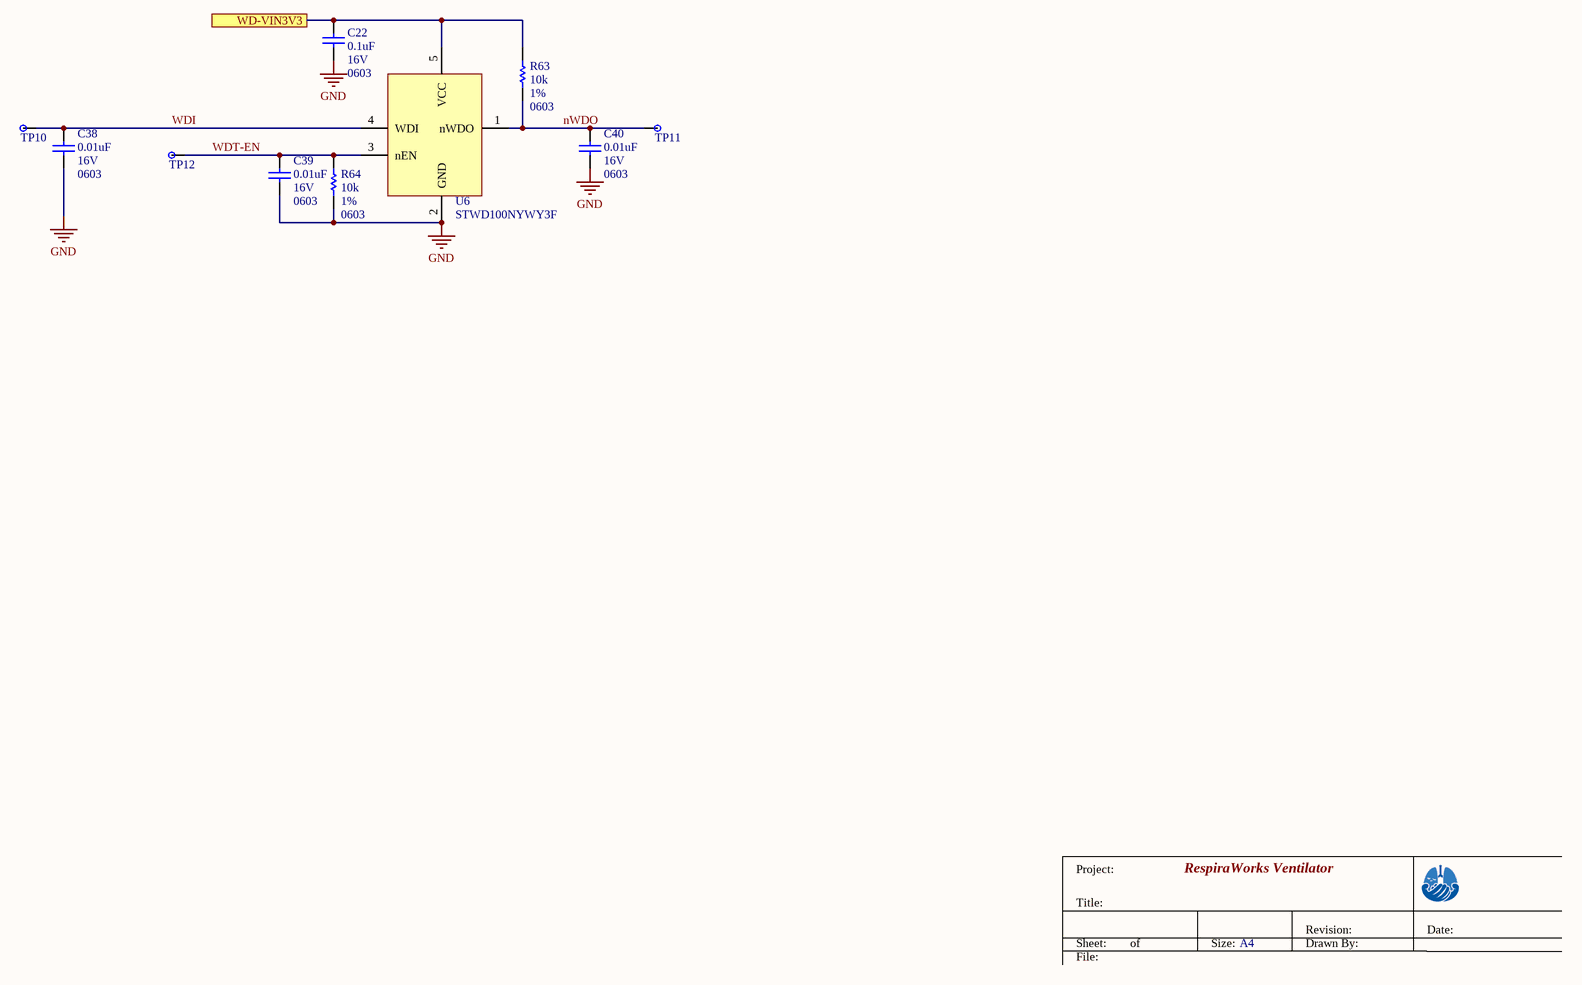
[diagram p4: Watchdog.SchDoc]

### Parts
C22  value 0.1uF  Voltage: 16V  PCB Package: 0603  [CAP0603]  (hidden comment: CAP 0603)
C38  value 0.01uF  Voltage: 16V  PCB Package: 0603  [CAP0603]  (hidden comment: CAP 0603)
C39  value 0.01uF  Voltage: 16V  PCB Package: 0603  [CAP0603]  (hidden comment: CAP 0603)
C40  value 0.01uF  Voltage: 16V  PCB Package: 0603  [CAP0603]  (hidden comment: CAP 0603)
R63  value 10k  PCB Package: 0603  Tolerance: 1%  [RES0603]  (hidden comment: RES 0603)
R64  value 10k  PCB Package: 0603  Tolerance: 1%  [RES0603]  (hidden comment: RES 0603)
TP10  TP-SMT  [TP-5015]  (value not drawn)
TP11  TP-SMT  [TP-5015]  (value not drawn)
TP12  TP-SMT  [TP-5015]  (value not drawn)
U6  STWD100NYWY3F  [5-SOT23]

### Ports
WD-VIN3V3

### Nets
CC-3V3: C22.1 R63.2 U6.5(VCC) ; port WD-VIN3V3
GND: C22.2 C38.2 C39.2 C40.2 R64.1 U6.2(GND)
nWDO: C40.1 R63.1 TP11.1 U6.1(nWDO)
WDI: C38.1 TP10.1 U6.4(WDI)
WDT-EN: C39.1 R64.2 TP12.1 U6.3(nEN)

### Notes on the sheet
- Project:
- RespiraWorks Ventilator
- Title:
- Sheet:
- of
- Size:
- A4
- Drawn By:
- Revision:
- Date:
- File:

### Library data of the parts
C22 = CAP 0603: as C1 on sheet Cycle-Controller-Onboard; Do Not Populate: *
C38-C40 = CAP 0603: as C11 on sheet Sensors; Do Not Populate: *
R63 R64 = RES 0603: as R59 on sheet TOP; Do Not Populate: *
TP10-TP12 = TP-SMT: as TP1 on sheet TOP; Manufacturer: Keystone; PCB Package: TP-5015; Tolerance: 5015; Do Not Populate: *; Value: *
U6 = STWD100NYWY3F: Watchdog Timer Circuit, 1.6s timeout; Manufacturer: ST; PCB Package: SOT-23-5; Manufacturer P/N: STWD100NYWY3F; Timeout: 1.6s; Do Not Populate: *

## Sheet Power.SchDoc: RespiraWorks
size A3; CompanyName: RespiraWorks; DrawnBy: E. Chiu; Organization: Altium; DocumentNumber: 2; Revision: A1; SheetNumber: 2; SheetTotal: 8; PageSetup: Record=PageOptions|CenterHorizontal=True|CenterVertical=True|PrintScale=0.67|XCorrection=1.00|YCorrection=1.00|PrintKind=0|BorderSize=5000000|LeftOffset=0|BottomOffset=0|Orientation=2|PaperLength=1000|PaperWidth=1000|Scale=100|PaperSource=276|PrintQuality=-3|MediaType=1|DitherType=10|PrintScaleMode=1|PaperKind=11"x17" 279.4x431.8mm|PaperIndex=3; ProjectName: FALCON 3S
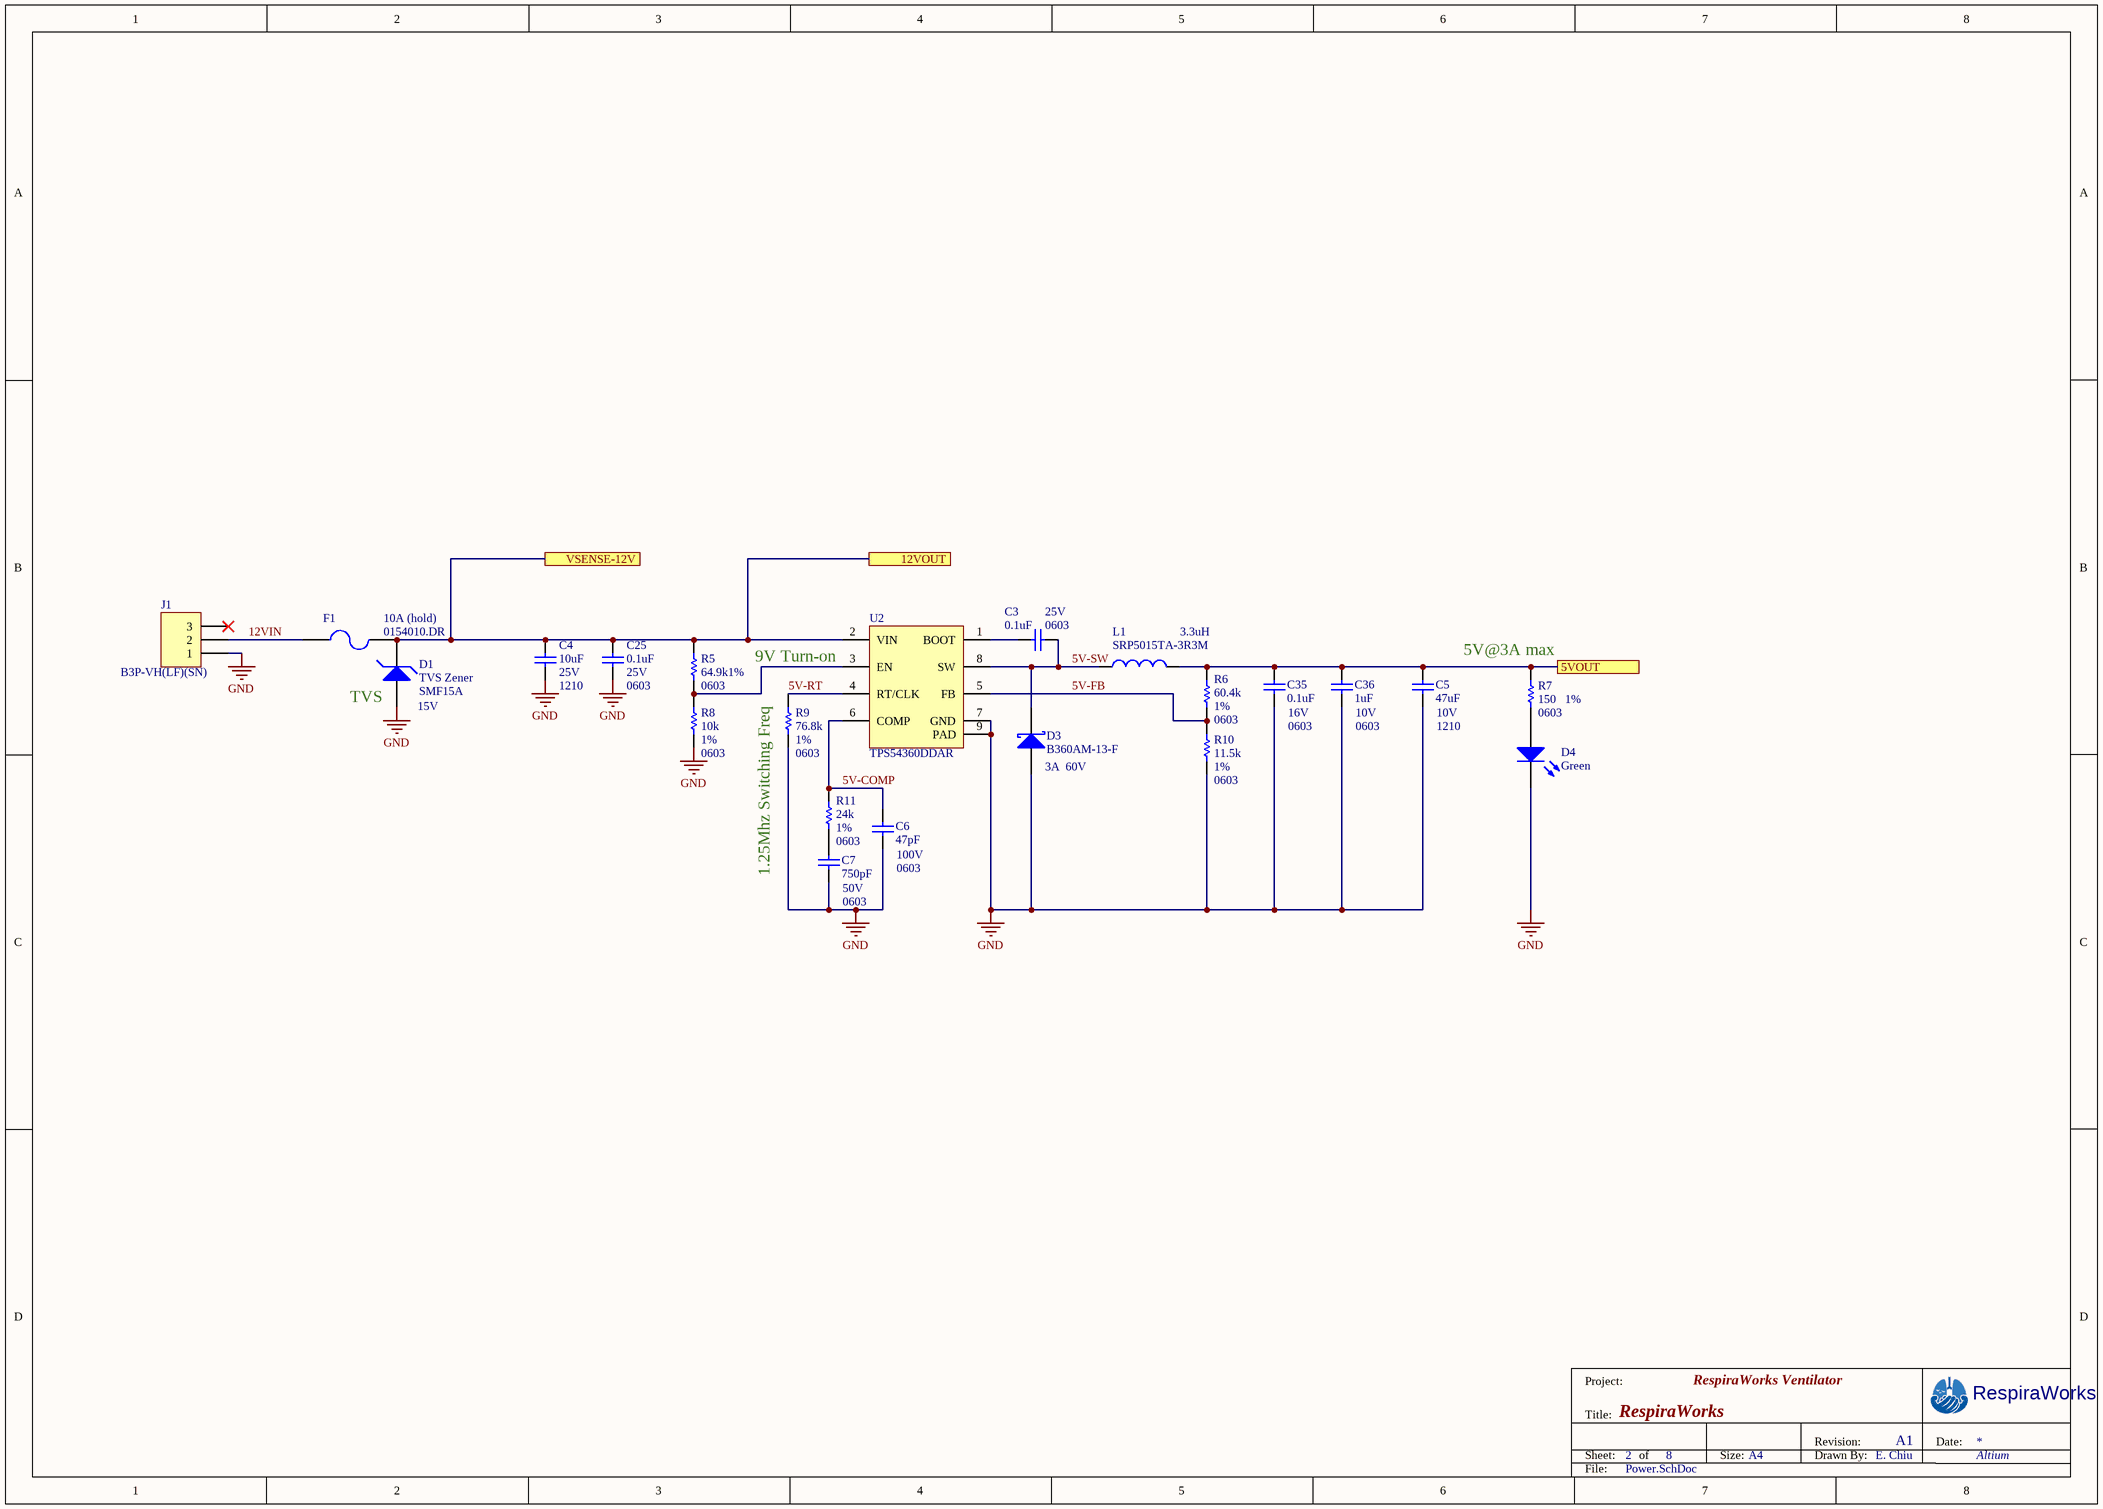
[diagram p5: Power.SchDoc]

### Parts
C3  value 0.1uF  Voltage: 25V  PCB Package: 0603  [CAP0603]  (hidden comment: CAP 0603)
C4  value 10uF  Voltage: 25V  PCB Package: 1210  [CAP1210]  (hidden comment: CAP 1210)
C5  value 47uF  Voltage: 10V  PCB Package: 1210  [CAP1210]  (hidden comment: CAP 1210)
C6  value 47pF  Voltage: 100V  PCB Package: 0603  [CAP0603]  (hidden comment: CAP 0603)
C7  value 750pF  Voltage: 50V  PCB Package: 0603  [CAP0603]  (hidden comment: CAP 0603)
C25  value 0.1uF  Voltage: 25V  PCB Package: 0603  [CAP0603]  (hidden comment: CAP 0603)
C35  value 0.1uF  Voltage: 16V  PCB Package: 0603  [CAP0603]  (hidden comment: CAP 0603)
C36  value 1uF  Voltage: 10V  PCB Package: 0603  [CAP0603]  (hidden comment: CAP 0603)
D1  TVS Zener  Vr: 15V  [SOD-123F]
D3  Reverse Voltage: 60V  I(max): 3A  [DO-214AC]  (hidden comment: *)
D4  value Green  [LED0603]  (hidden comment: LED 0603)
F1  value 10A (hold)  Manufacturer P/N: 0154010.DR  [0154]  (hidden comment: Fast Blow)
J1  B3P-VH(LF)(SN)  [B3P-VH(LF)(SN)]
L1  value 3.3uH  [SRP5015]  (hidden comment: SRP5015TA-3R3M)
R5  value 64.9k  PCB Package: 0603  Tolerance: 1%  [RES0603]  (hidden comment: RES 0603)
R6  value 60.4k  PCB Package: 0603  Tolerance: 1%  [RES0603]  (hidden comment: RES 0603)
R7  value 150  PCB Package: 0603  Tolerance: 1%  [RES0603]  (hidden comment: RES 0603)
R8  value 10k  PCB Package: 0603  Tolerance: 1%  [RES0603]  (hidden comment: RES 0603)
R9  value 76.8k  PCB Package: 0603  Tolerance: 1%  [RES0603]  (hidden comment: RES 0603)
R10  value 11.5k  PCB Package: 0603  Tolerance: 1%  [RES0603]  (hidden comment: RES 0603)
R11  value 24k  PCB Package: 0603  Tolerance: 1%  [RES0603]  (hidden comment: RES 0603)
U2  Manufacturer P/N: TPS54360DDAR  [DDA]  (hidden comment: TPS54360)

### Ports
5VOUT, 12VOUT, VSENSE-12V

### Nets
5V: C5.2 C35.1 C36.1 L1.2 R6.2 R7.2 ; port 5VOUT
12V: C4.2 C25.1 D1.K F1.2 R5.2 U2.2(VIN) ; port VSENSE-12V, port 12VOUT
GND: C4.1 C5.1 C6.1 C7.1 C25.2 C35.2 C36.2 D1.A D3.A D4.K J1.1 R8.1 R9.1 R10.1 U2.7(GND) U2.9(PAD)
5V-COMP: C6.2 R11.2 U2.6(COMP)
5V-FB: R6.1 R10.2 U2.5(FB)
5V-RT: R9.2 U2.4(RT/CLK)
5V-SW: C3.2 D3.K L1.1 U2.8(SW)
12VIN: F1.1 J1.2
NetC3_1: C3.1 U2.1(BOOT)
NetC7_2: C7.2 R11.1
NetD4_A: D4.A R7.1
NetR5_1: R5.1 R8.2 U2.3(EN)

Not connected (* = marked no-connect by the designer): J1 3*

### Notes on the sheet
- (near D1) TVS
- 9V Turn-on
- (near R7) 5V@3A max
- (near R9) 1.25Mhz Switching Freq
- Project:
- RespiraWorks Ventilator
- Title:
- Sheet:
- of
- Size:
- A4
- Drawn By:
- Revision:
- Date:
- File:

### Library data of the parts
C3 C25 = CAP 0603: Manufacturer P/N: CC0603KRX7R8BB104; Manufacturer: Yageo; Type: X7R; Do Not Populate: *
C4 = CAP 1210: Manufacturer P/N: GRM32DR71E106KA12L; Manufacturer: Murata; Type: X7R; Do Not Populate: *
C5 = CAP 1210: Manufacturer P/N: GRM32ER71A476KE15L; Manufacturer: Murata; Type: X7R; Do Not Populate: *
C6 = CAP 0603: Manufacturer P/N: C0603C470J1GACTU; Manufacturer: Kemet; Type: NP0; Do Not Populate: *
C7 = CAP 0603: Manufacturer P/N: CL10B751KB8NNNC; Manufacturer: Samsung; Type: X7R; Do Not Populate: *
C35 = CAP 0603: as C1 on sheet Cycle-Controller-Onboard; Do Not Populate: *
C36 = CAP 0603: as C23 on sheet Cycle-Controller-Onboard; Do Not Populate: *
D1 = SMF15A: TVS Diode, Zener, 15V Standoff, 24V Clamp, 8.2A; Manufacturer: Littelfuse; Vbr(min): 16.7V; Do Not Populate: *; PCB Package: SOD-123F; I(pulse): 8.2A; Manufacturer P/N: SMF15A
D3 = B360AM-13-F: DIODE SCHOTTKY 60V 3A SMA; Manufacturer: Diodes Inc.; PCB Package: DO-214AC (SMA); Do Not Populate: *; Type: Schottky; Manufacturer P/N: B360AM-13-F
D4 = LED 0603: as D2 on sheet Cycle-Controller-Onboard; Color: Green; Do Not Populate: *
F1 = 0154010: Fast Blow Nano Fuse in Holder, 10A, 125V; Manufacturer: Littelfuse; V(max): 125V AC/DC; I(hold): 10A; I(trip): 10A
J1 = B3P-VH(LF)(SN): JST-VH HEADER VERT 3POS 3.96MM; Manufacturer: JST; Do Not Populate: *; Manufacturer P/N: B3P-VH(LF)(SN)
L1 = SRP5015TA-3R3M: Inductor, 501 Series, Shielded 2.2uH, 4A; Manufacturer: Bourns; I(rms): 3.2A; I(sat): 4.5A; DCR: 78mohm; Do Not Populate: *; PCB Package: SRP5015; Manufacturer P/N: SRP5015TA-3R3M
R5 = RES 0603: Manufacturer P/N: RC0603FR-0764K9L; Manufacturer: Yageo; Do Not Populate: *
R6 = RES 0603: Manufacturer P/N: RC0603FR-0760K4L; Manufacturer: Yageo; Do Not Populate: *
R7 = RES 0603: Manufacturer P/N: ERJ-3EKF1500V; Manufacturer: Panasonic; Do Not Populate: *
R8 = RES 0603: as R59 on sheet TOP; Do Not Populate: *
R9 = RES 0603: Manufacturer P/N: RC0603FR-0776K8L; Manufacturer: Yageo; Do Not Populate: *
R10 = RES 0603: Manufacturer P/N: RC0603FR-0711K5L; Manufacturer: Yageo; Do Not Populate: *
R11 = RES 0603: Manufacturer P/N: ERJ-3EKF2402V; Manufacturer: Panasonic; Do Not Populate: *
U2 = TPS54360: DC-DC Buck, 60V Input, 3.5A Int Sw, Ultra Low Quiescent Power; Manufacturer: Texas Instruments; PCB Package: SOIC8; Do Not Populate: *